# Altium project PCB_Project1.PrjPCB (part 1 of 2)
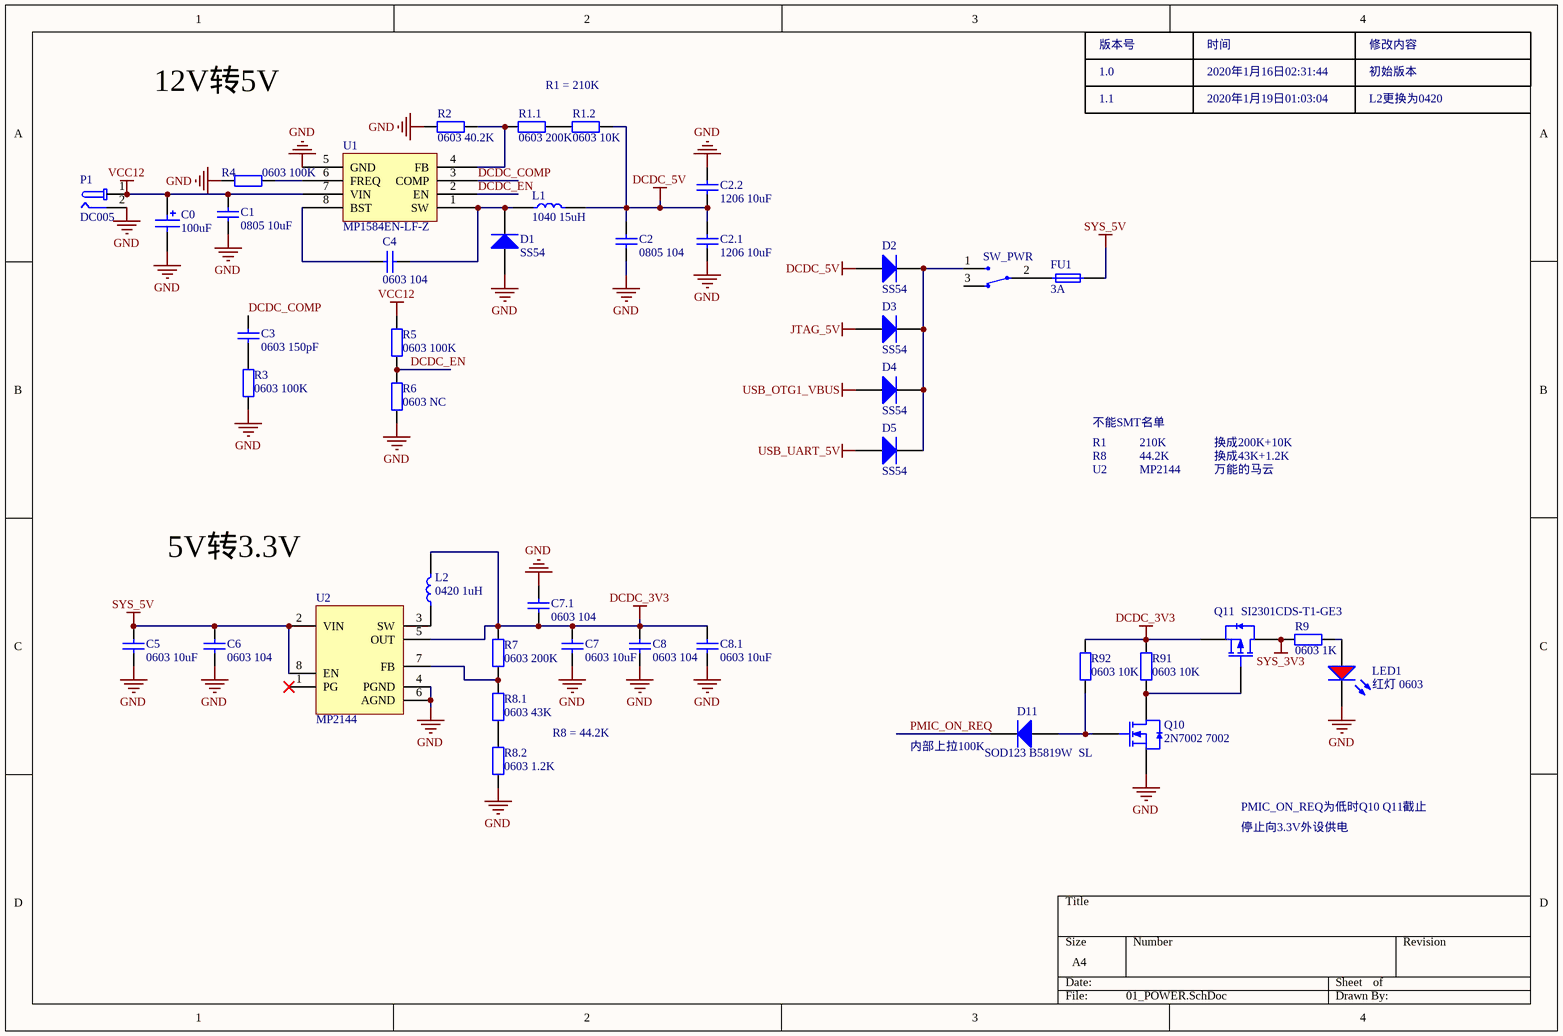
[diagram p0: 01_POWER.SchDoc]
12 sheets, 301 parts. Net scope: global (net labels, ports and power ports of the same name join across sheets).
Board file: PCB1.PcbDoc
Sheets:
  01_POWER.SchDoc
  02_BTB_IO.SchDoc
  03_ENET.SchDoc
  04_BOOT.SchDoc
  05_USB.SchDoc
  06_SDIO.SchDoc
  07_AUDIO.SchDoc
  08_PERIPHERAL.SchDoc
  09_RGB_LCD.SchDoc
  10_HDMI.SchDoc
  11_HDMI_CON.SchDoc
  12_IO.SchDoc

## Sheet 01_POWER.SchDoc
size A4

### Parts
C0  100uF  [CAP1]
C1  0805 10uF  [LC-0805_C]
C2  0805 104  [LC-0805_C]
C2.1  1206 10uF  [LC-1206_C]
C2.2  1206 10uF  [LC-1206_C]
C3  0603 150pF  [LC-0603_C]
C4  0603 104  [LC-0603_C]
C5  0603 10uF  [LC-0603_C]
C6  0603 104  [LC-0603_C]
C7  0603 10uF  [LC-0603_C]
C7.1  0603 104  [LC-0603_C]
C8  0603 104  [LC-0603_C]
C8.1  0603 10uF  [LC-0603_C]
D1  SS54  [LC-SMA(DO-214AC)_S1]
D2  SS54  [LC-SMA(DO-214AC)_S1]
D3  SS54  [LC-SMA(DO-214AC)_S1]
D4  SS54  [LC-SMA(DO-214AC)_S1]
D5  SS54  [LC-SMA(DO-214AC)_S1]
D11  SOD123 B5819W  SL  [LC-SOD-123]
FU1  3A  [1812_FUSOR]
L1  1040 15uH  [L_1040]
L2  0420 1uH  [L_0420]
LED1  红灯 0603  [LC-0603_LED_S1]
P1  DC005  [DC005]
Q10  2N7002 7002  [LC-SOT-23(SOT-23-3)]
Q11  SI2301CDS-T1-GE3  [LC-SOT-23(SOT-23-3)]
R1.1  0603 200K  [LC-0603_R]
R1.2  0603 10K  [LC-0603_R]
R2  0603 40.2K  [LC-0603_R]
R3  0603 100K  [LC-0603_R]
R4  0603 100K  [LC-0603_R]
R5  0603 100K  [LC-0603_R]
R6  0603 NC  [LC-0603_R]
R7  0603 200K  [LC-0603_R]
R8.1  0603 43K  [LC-0603_R]
R8.2  0603 1.2K  [LC-0603_R]
R9  0603 1K  [LC-0603_R]
R91  0603 10K  [LC-0603_R]
R92  0603 10K  [LC-0603_R]
SW_PWR  (no value)  [SW_3P1]
U1  MP1584EN-LF-Z  [LC-SOIC-8_EP_150mil]
U2  MP2144  [SOT23-8L]

### Nets
DCDC_3V3: C7.2 C7.1.2 C8.2 C8.1.2 L2.1 Q11.2(S) R7.2 R91.2 R92.2 U2.5(OUT)
DCDC_5V: C2.2 C2.1.2 C2.2.2 D2.1(A) L1.1 R1.2.2
GND: C0.2 C1.1 C2.1 C2.1.1 C2.2.1 C5.1 C6.1 C7.1 C7.1.1 C8.1 C8.1.1 D1.1(A) LED1.K P1.2 Q10.2(S) R2.1 R3.1 R4.1 R6.1 R8.2.1 U1.5(GND) U2.4(PGND) U2.6(AGND)
JTAG_5V: D3.1(A)
SYS_3V3: Q11.3(D) R9.2
SYS_5V: C5.2 C6.2 FU1.2 U2.2(VIN) U2.8(EN)
USB_OTG1_VBUS: D4.1(A)
USB_UART_5V: D5.1(A)
VCC12: C0.1 C1.2 P1.1 R5.2 U1.7(VIN)
DCDC_COMP: C3.2 U1.3(COMP)
DCDC_EN: R5.1 R6.2 U1.2(EN)
PMIC_ON_REQ: D11.2(K)
NetC3_1: C3.1 R3.2
NetC4_1: C4.1 U1.8(BST)
NetC4_2: C4.2 D1.2(K) L1.2 U1.1(SW)
NetD2_2: D2.2(K) D3.2(K) D4.2(K) D5.2(K) SW_PWR.1
NetD11_1: D11.1(A) Q10.1(G) R92.1
NetFU1_1: FU1.1 SW_PWR.2
NetL2_2: L2.2 U2.3(SW)
NetLED1_A: LED1.A R9.1
NetQ10_3: Q10.3(D) Q11.1(G) R91.1
NetR1.1_1: R1.1.1 R2.2 U1.4(FB)
NetR1.1_2: R1.1.2 R1.2.1
NetR4_2: R4.2 U1.6(FREQ)
NetR7_1: R7.1 R8.1.2 U2.7(FB)
NetR8.1_1: R8.1.1 R8.2.2

Not connected (* = marked no-connect by the designer): SW_PWR 3; U2 1(PG)*

### Notes on the sheet
- 12V转5V
- R1 = 210K
- 版本号
- 1.0
- 1.1
- 2020年1月16日02:31:44
- 时间
- 2020年1月19日01:03:04
- 修改内容
- 初始版本
- L2更换为0420
- R1
- 不能SMT名单
- 210K
- 换成200K+10K
- R8
- U2
- 44.2K
- MP2144
- 换成43K+1.2K
- 万能的马云
- 5V转3.3V
- R8 = 44.2K
- 内部上拉100K
- PMIC_ON_REQ为低时Q10 Q11截止
- 停止向3.3V外设供电

### Library data of the parts
C0 = CAP1
C1 C2 = 0805 10uF (106) 10% 25V: 贴片电容; ComponentLink1Description: 供应商链接; ComponentLink1URL: http://www.szlcsc.com/product/details_16532.html; Package: 0805; Supplier: LC; SuppliersPartNumber: C15850
C2.1 C2.2 = 1206 10uF (106) 10% 50V: 贴片电容; ComponentLink1Description: 供应商链接; ComponentLink1URL: http://www.szlcsc.com/product/details_14236.html; Package: 1206; Supplier: LC; SuppliersPartNumber: C13585
C3-C7 C7.1 C8 C8.1 = 0603 1uF (105) 10% 50V: 贴片电容; ComponentLink1Description: 供应商链接; ComponentLink1URL: http://www.szlcsc.com/product/details_16531.html; Package: 0603; Supplier: LC; SuppliersPartNumber: C15849
D1-D5 = SMA(DO-214AC) SS54: 二极管; ComponentLink1Description: 供应商链接; ComponentLink1URL: http://www.szlcsc.com/product/details_23178.html; Package: SMA(DO-214AC); Supplier: LC; SuppliersPartNumber: C22452
D11 = SOD-123 B5819W  SL: 肖特基二极管; ComponentLink1Description: 供应商链接; ComponentLink1URL: http://www.szlcsc.com/product/details_9093.html; Package: SOD-123; Supplier: LC; SuppliersPartNumber: C8598
FU1 = FU
L1 L2 = Inductor
LED1 = 0603 红灯: 发光二极管; ComponentLink1Description: 供应商链接; ComponentLink1URL: http://www.szlcsc.com/product/details_2659.html; Package: 0603; Supplier: LC; SuppliersPartNumber: C2286
Q10 = 2N7002 7002: MOS(场效应管); ComponentLink1Description: 供应商链接; ComponentLink1URL: http://www.szlcsc.com/product/details_9040.html; Package: SOT-23(SOT-23-3); Supplier: LC; SuppliersPartNumber: C8545
Q11 = SI2301CDS-T1-GE3: MOS(场效应管); ComponentLink1Description: 供应商链接; ComponentLink1URL: http://www.szlcsc.com/product/details_11030.html; Package: SOT-23(SOT-23-3); Supplier: LC; SuppliersPartNumber: C10487
R1.1 R1.2 R2-R7 R8.1 R8.2 R9 = 0603 2.2KΩ (2201) 1%: 贴片电阻; ComponentLink1Description: 供应商链接; ComponentLink1URL: http://www.szlcsc.com/product/details_4597.html; Package: 0603; Supplier: LC; SuppliersPartNumber: C4190
R91 R92 = 0603 1.1KΩ (1101) 1%: 贴片电阻; ComponentLink1Description: 供应商链接; ComponentLink1URL: http://www.szlcsc.com/product/details_23491.html; Package: 0603; Supplier: LC; SuppliersPartNumber: C22764
SW_PWR = SW_3P
U1 = MP1584EN-LF-Z: DC-DC芯片; ComponentLink1Description: 供应商链接; ComponentLink1URL: http://www.szlcsc.com/product/details_15724.html; Package: SOIC-8_EP_150mil; Supplier: LC; SuppliersPartNumber: C15051

## Sheet 02_BTB_IO.SchDoc
size A4
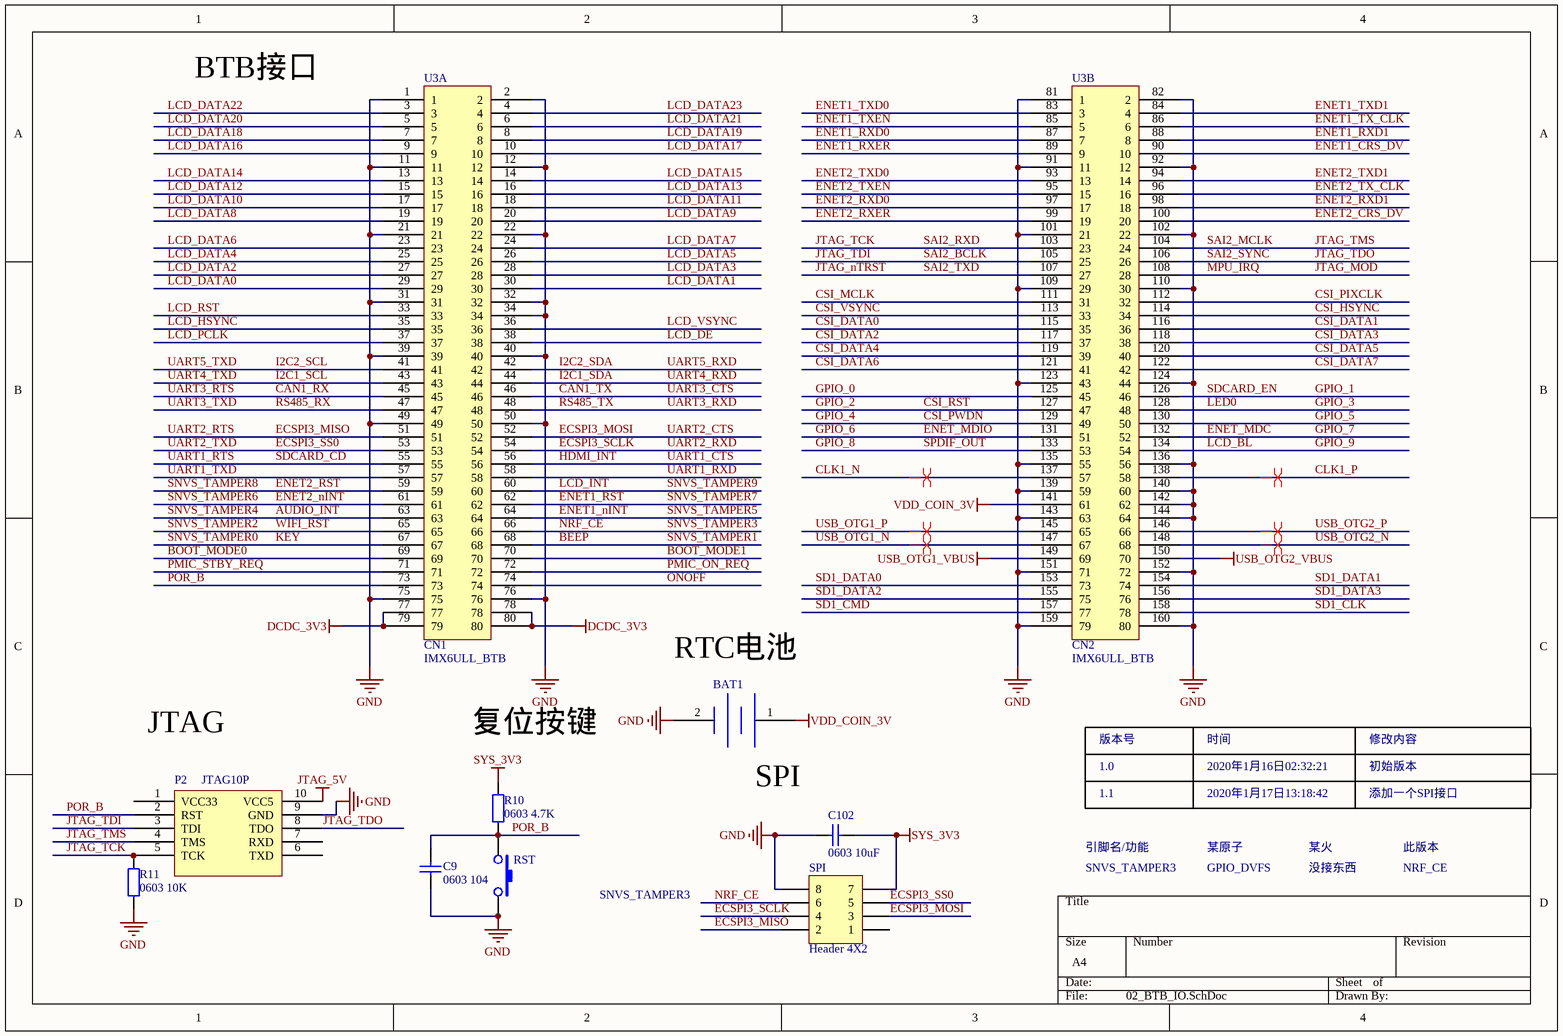
[diagram p1: 02_BTB_IO.SchDoc]

### Parts
BAT1  (no value)  [CR1220]
C9  0603 104  [LC-0603_C]
C102  0603 10uF  [LC-0603_C]
P2  JTAG10P  [JTAG10P2]
R10  0603 4.7K  [LC-0603_R]
R11  0603 10K  [LC-0603_R]
RST  (no value)  [KEY2]
SPI  Header 4X2  [HDR2X4]
U3  IMX6ULL_BTB  [IMX6ULL_BTB]  (parts A,B of 2)

### Nets
DCDC_3V3: U3.77 U3.78 U3.79 U3.80
GND: BAT1.2 C9.1 C102.1 P2.9(GND) R11.1 RST.2 SPI.8 U3.1 U3.2 U3.11 U3.12 U3.21 U3.22 U3.31 U3.32 U3.34 U3.39 U3.40 U3.49 U3.50 U3.75 U3.76 U3.81(1) U3.82(2) U3.91(11) U3.92(12) U3.101(21) U3.102(22) U3.109(29) U3.110(30) U3.123(43) U3.124(44) U3.135(55) U3.136(56) U3.139(59) U3.140(60) U3.142(62) U3.143(63) U3.144(64) U3.151(71) U3.152(72) U3.159(79) U3.160(80)
JTAG_5V: P2.10(VCC5)
SYS_3V3: C102.2 R10.2 SPI.7
USB_OTG1_VBUS: U3.149(69)
USB_OTG2_VBUS: U3.150(70)  [project net SYS_5V]
VDD_COIN_3V: BAT1.1 U3.141(61)
AUDIO_INT: U3.63  [also labelled SNVS_TAMPER4]
BEEP: U3.68  [also labelled SNVS_TAMPER1]
BOOT_MODE0: U3.69
BOOT_MODE1: U3.70
CAN1_RX: U3.45  [also labelled UART3_RTS]
CAN1_TX: U3.46  [also labelled UART3_CTS]
CLK1_N: U3.137(57)
CLK1_P: U3.138(58)
CSI_DATA0: U3.115(35)
CSI_DATA1: U3.116(36)
CSI_DATA2: U3.117(37)
CSI_DATA3: U3.118(38)
CSI_DATA4: U3.119(39)
CSI_DATA5: U3.120(40)
CSI_DATA6: U3.121(41)
CSI_DATA7: U3.122(42)
CSI_HSYNC: U3.114(34)
CSI_MCLK: U3.111(31)
CSI_PIXCLK: U3.112(32)
CSI_PWDN: U3.129(49)  [also labelled GPIO_4]
CSI_RST: U3.127(47)  [also labelled GPIO_2]
CSI_VSYNC: U3.113(33)
ECSPI3_MISO: SPI.2 U3.51  [also labelled UART2_RTS]
ECSPI3_MOSI: SPI.3 U3.52  [also labelled UART2_CTS]
ECSPI3_SCLK: SPI.4 U3.54  [also labelled UART2_RXD]
ECSPI3_SS0: SPI.5 U3.53  [also labelled UART2_TXD]
ENET1_CRS_DV: U3.90(10)
ENET1_nINT: U3.64  [also labelled SNVS_TAMPER5]
ENET1_RST: U3.62  [also labelled SNVS_TAMPER7]
ENET1_RXD0: U3.87(7)
ENET1_RXD1: U3.88(8)
ENET1_RXER: U3.89(9)
ENET1_TX_CLK: U3.86(6)
ENET1_TXD0: U3.83(3)
ENET1_TXD1: U3.84(4)
ENET1_TXEN: U3.85(5)
ENET2_CRS_DV: U3.100(20)
ENET2_nINT: U3.61  [also labelled SNVS_TAMPER6]
ENET2_RST: U3.59  [also labelled SNVS_TAMPER8]
ENET2_RXD0: U3.97(17)
ENET2_RXD1: U3.98(18)
ENET2_RXER: U3.99(19)
ENET2_TX_CLK: U3.96(16)
ENET2_TXD0: U3.93(13)
ENET2_TXD1: U3.94(14)
ENET2_TXEN: U3.95(15)
ENET_MDC: U3.132(52)  [also labelled GPIO_7]
ENET_MDIO: U3.131(51)  [also labelled GPIO_6]
GPIO_0: U3.125(45)
GPIO_1: U3.126(46)  [also labelled SDCARD_EN]
GPIO_3: U3.128(48)  [also labelled LED0]
GPIO_5: U3.130(50)
GPIO_8: U3.133(53)  [also labelled SPDIF_OUT]
GPIO_9: U3.134(54)  [also labelled LCD_BL]
HDMI_INT: U3.56  [also labelled UART1_CTS]
I2C1_SCL: U3.43  [also labelled UART4_TXD]
I2C1_SDA: U3.44  [also labelled UART4_RXD]
I2C2_SCL: U3.41  [also labelled UART5_TXD]
I2C2_SDA: U3.42  [also labelled UART5_RXD]
JTAG_MOD: U3.108(28)  [also labelled MPU_IRQ]
JTAG_nTRST: U3.107(27)  [also labelled SAI2_TXD]
JTAG_TCK: P2.5(TCK) R11.2 U3.103(23)  [also labelled SAI2_RXD]
JTAG_TDI: P2.3(TDI) U3.105(25)  [also labelled SAI2_BCLK]
JTAG_TDO: P2.8(TDO) U3.106(26)  [also labelled SAI2_SYNC]
JTAG_TMS: P2.4(TMS) U3.104(24)  [also labelled SAI2_MCLK]
KEY: U3.67  [also labelled SNVS_TAMPER0]
LCD_DATA0: U3.29
LCD_DATA1: U3.30
LCD_DATA2: U3.27
LCD_DATA3: U3.28
LCD_DATA4: U3.25
LCD_DATA5: U3.26
LCD_DATA6: U3.23
LCD_DATA7: U3.24
LCD_DATA8: U3.19
LCD_DATA9: U3.20
LCD_DATA10: U3.17
LCD_DATA11: U3.18
LCD_DATA12: U3.15
LCD_DATA13: U3.16
LCD_DATA14: U3.13
LCD_DATA15: U3.14
LCD_DATA16: U3.9
LCD_DATA17: U3.10
LCD_DATA18: U3.7
LCD_DATA19: U3.8
LCD_DATA20: U3.5
LCD_DATA21: U3.6
LCD_DATA22: U3.3
LCD_DATA23: U3.4
LCD_DE: U3.38
LCD_HSYNC: U3.35
LCD_INT: U3.60  [also labelled SNVS_TAMPER9]
LCD_PCLK: U3.37
LCD_RST: U3.33
LCD_VSYNC: U3.36
NRF_CE: SPI.6 U3.66  [also labelled SNVS_TAMPER3]
ONOFF: U3.74
PMIC_ON_REQ: U3.72
PMIC_STBY_REQ: U3.71
POR_B: C9.2 P2.2(RST) R10.1 RST.1 U3.73
RS485_RX: U3.47  [also labelled UART3_TXD]
RS485_TX: U3.48  [also labelled UART3_RXD]
SD1_CLK: U3.158(78)
SD1_CMD: U3.157(77)
SD1_DATA0: U3.153(73)
SD1_DATA1: U3.154(74)
SD1_DATA2: U3.155(75)
SD1_DATA3: U3.156(76)
SDCARD_CD: U3.55  [also labelled UART1_RTS]
SNVS_TAMPER2: U3.65  [also labelled WIFI_RST]
UART1_RXD: U3.58
UART1_TXD: U3.57
USB_OTG1_N: U3.147(67)
USB_OTG1_P: U3.145(65)
USB_OTG2_N: U3.148(68)
USB_OTG2_P: U3.146(66)

Not connected (* = marked no-connect by the designer): P2 1(VCC33) 6(TXD) 7(RXD); SPI 1

### Layout directives
differential pair: CLK1_N, CLK1_P, USB_OTG1_N, USB_OTG1_P, USB_OTG2_N, USB_OTG2_P

### Notes on the sheet
- BTB接口
- RTC电池
- JTAG
- 复位按键
- SPI
- 版本号
- 1.0
- 2020年1月16日02:32:21
- 时间
- 修改内容
- 初始版本
- 引脚名/功能
- 1.1
- 某原子
- 2020年1月17日13:18:42
- 某火
- 添加一个SPI接口
- 此版本
- SNVS_TAMPER3
- GPIO_DVFS
- 没接东西
- NRF_CE
- (in symbol IMX6ULL_BTB, part A) CN1
- (in symbol IMX6ULL_BTB, part B) CN2

### Library data of the parts
BAT1 = RTC电池
C9 C102 = 0603 1.5nF (152) 10% 50V: 贴片电容; ComponentLink1Description: 供应商链接; ComponentLink1URL: http://www.szlcsc.com/product/details_1947.html; Package: 0603; Supplier: LC; SuppliersPartNumber: C1595
R10 R11 = 0603 1.1KΩ (1101) 1%: 贴片电阻; ComponentLink1Description: 供应商链接; ComponentLink1URL: http://www.szlcsc.com/product/details_23491.html; Package: 0603; Supplier: LC; SuppliersPartNumber: C22764
RST = KEY
SPI = Header 4X2: Header, 4-Pin, Dual row; LatestRevisionDate: 17-Jul-2002; LatestRevisionNote: Re-released for DXP Platform.; Publisher: Altium Limited

## Sheet 03_ENET.SchDoc
size A4
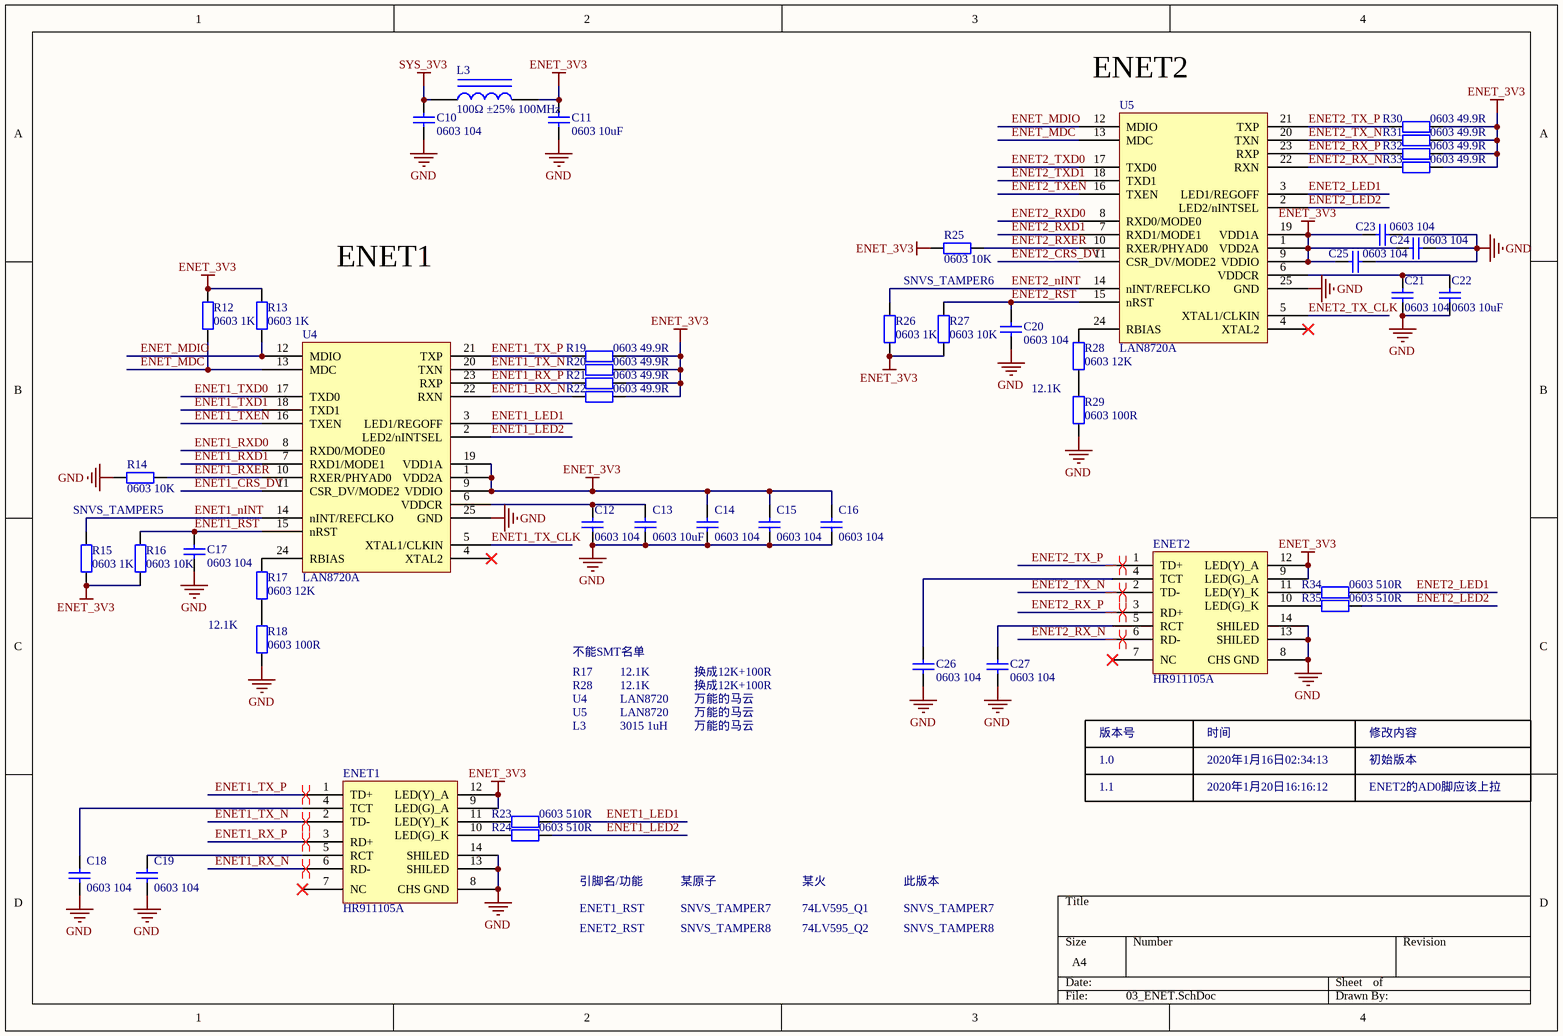
[diagram p2: 03_ENET.SchDoc]

### Parts
C10  0603 104  [LC-0603_C]
C11  0603 10uF  [LC-0603_C]
C12  0603 104  [LC-0603_C]
C13  0603 10uF  [LC-0603_C]
C14  0603 104  [LC-0603_C]
C15  0603 104  [LC-0603_C]
C16  0603 104  [LC-0603_C]
C17  0603 104  [LC-0603_C]
C18  0603 104  [LC-0603_C]
C19  0603 104  [LC-0603_C]
C20  0603 104  [LC-0603_C]
C21  0603 104  [LC-0603_C]
C22  0603 10uF  [LC-0603_C]
C23  0603 104  [LC-0603_C]
C24  0603 104  [LC-0603_C]
C25  0603 104  [LC-0603_C]
C26  0603 104  [LC-0603_C]
C27  0603 104  [LC-0603_C]
ENET1  HR911105A  [HR911105A]
ENET2  HR911105A  [HR911105A]
L3  100Ω ±25% 100MHz  [LC-0805_L]
R12  0603 1K  [LC-0603_R]
R13  0603 1K  [LC-0603_R]
R14  0603 10K  [LC-0603_R]
R15  0603 1K  [LC-0603_R]
R16  0603 10K  [LC-0603_R]
R17  0603 12K  [LC-0603_R]
R18  0603 100R  [LC-0603_R]
R19  0603 49.9R  [LC-0603_R]
R20  0603 49.9R  [LC-0603_R]
R21  0603 49.9R  [LC-0603_R]
R22  0603 49.9R  [LC-0603_R]
R23  0603 510R  [LC-0603_R]
R24  0603 510R  [LC-0603_R]
R25  0603 10K  [LC-0603_R]
R26  0603 1K  [LC-0603_R]
R27  0603 10K  [LC-0603_R]
R28  0603 12K  [LC-0603_R]
R29  0603 100R  [LC-0603_R]
R30  0603 49.9R  [LC-0603_R]
R31  0603 49.9R  [LC-0603_R]
R32  0603 49.9R  [LC-0603_R]
R33  0603 49.9R  [LC-0603_R]
R34  0603 510R  [LC-0603_R]
R35  0603 510R  [LC-0603_R]
U4  LAN8720A  [QFN-24_4x4x05P]
U5  LAN8720A  [QFN-24_4x4x05P]

### Nets
ENET_3V3: C11.2 C14.2 C15.2 C16.2 C23.2 C24.2 C25.2 ENET1.9(LED(G)_A) ENET1.12(LED(Y)_A) ENET2.9(LED(G)_A) ENET2.12(LED(Y)_A) L3.2 R12.2 R13.2 R15.2 R16.2 R19.2 R20.2 R21.2 R22.2 R25.2 R26.2 R27.2 R30.2 R31.2 R32.2 R33.2 U4.1(VDD2A) U4.9(VDDIO) U4.19(VDD1A) U5.1(VDD2A) U5.9(VDDIO) U5.19(VDD1A)
GND: C10.1 C11.1 C12.1 C13.1 C14.1 C15.1 C16.1 C17.1 C18.1 C19.1 C20.1 C21.1 C22.1 C23.1 C24.1 C25.1 C26.2 C27.2 ENET1.8(CHS_GND) ENET1.13(SHILED) ENET1.14(SHILED) ENET2.8(CHS_GND) ENET2.13(SHILED) ENET2.14(SHILED) R14.2 R18.2 R29.2 U4.25(GND) U5.25(GND)
SYS_3V3: C10.2 L3.1
ENET1_CRS_DV: U4.11(CSR_DV/MODE2)
ENET1_LED1: R23.2 U4.3(LED1/REGOFF)
ENET1_LED2: R24.2 U4.2(LED2/nINTSEL)
ENET1_nINT: R15.1 U4.14(nINT/REFCLKO)
ENET1_RST: C17.2 R16.1 U4.15(nRST)
ENET1_RX_N: ENET1.6(RD-) R22.1 U4.22(RXN)
ENET1_RX_P: ENET1.3(RD+) R21.1 U4.23(RXP)
ENET1_RXD0: U4.8(RXD0/MODE0)
ENET1_RXD1: U4.7(RXD1/MODE1)
ENET1_RXER: R14.1 U4.10(RXER/PHYAD0)
ENET1_TX_CLK: U4.5(XTAL1/CLKIN)
ENET1_TX_N: ENET1.2(TD-) R20.1 U4.20(TXN)
ENET1_TX_P: ENET1.1(TD+) R19.1 U4.21(TXP)
ENET1_TXD0: U4.17(TXD0)
ENET1_TXD1: U4.18(TXD1)
ENET1_TXEN: U4.16(TXEN)
ENET2_CRS_DV: U5.11(CSR_DV/MODE2)
ENET2_LED1: R34.2 U5.3(LED1/REGOFF)
ENET2_LED2: R35.2 U5.2(LED2/nINTSEL)
ENET2_nINT: R26.1 U5.14(nINT/REFCLKO)
ENET2_RST: C20.2 R27.1 U5.15(nRST)
ENET2_RX_N: ENET2.6(RD-) R33.1 U5.22(RXN)
ENET2_RX_P: ENET2.3(RD+) R32.1 U5.23(RXP)
ENET2_RXD0: U5.8(RXD0/MODE0)
ENET2_RXD1: U5.7(RXD1/MODE1)
ENET2_RXER: R25.1 U5.10(RXER/PHYAD0)
ENET2_TX_CLK: U5.5(XTAL1/CLKIN)
ENET2_TX_N: ENET2.2(TD-) R31.1 U5.20(TXN)
ENET2_TX_P: ENET2.1(TD+) R30.1 U5.21(TXP)
ENET2_TXD0: U5.17(TXD0)
ENET2_TXD1: U5.18(TXD1)
ENET2_TXEN: U5.16(TXEN)
ENET_MDC: R12.1 U4.13(MDC) U5.13(MDC)
ENET_MDIO: R13.1 U4.12(MDIO) U5.12(MDIO)
NetC12_2: C12.2 C13.2 U4.6(VDDCR)
NetC18_2: C18.2 ENET1.4(TCT)
NetC19_2: C19.2 ENET1.5(RCT)
NetC21_2: C21.2 C22.2 U5.6(VDDCR)
NetC26_1: C26.1 ENET2.4(TCT)
NetC27_1: C27.1 ENET2.5(RCT)
NetENET1_10: ENET1.10(LED(G)_K) R24.1
NetENET1_11: ENET1.11(LED(Y)_K) R23.1
NetENET2_10: ENET2.10(LED(G)_K) R35.1
NetENET2_11: ENET2.11(LED(Y)_K) R34.1
NetR17_1: R17.1 U4.24(RBIAS)
NetR17_2: R17.2 R18.1
NetR28_1: R28.1 U5.24(RBIAS)
NetR28_2: R28.2 R29.1

Not connected (* = marked no-connect by the designer): ENET1 7(NC)*; ENET2 7(NC)*; U4 4(XTAL2)*; U5 4(XTAL2)*

### Layout directives
differential pair: ENET1_RX_N, ENET1_RX_P, ENET1_TX_N, ENET1_TX_P, ENET2_RX_N, ENET2_RX_P, ENET2_TX_N, ENET2_TX_P

### Notes on the sheet
- (near U5) ENET2
- ENET1
- SNVS_TAMPER6
- 12.1K
- SNVS_TAMPER5
- 不能SMT名单
- R17
- R28
- U4
- U5
- LAN8720
- 换成12K+100R
- 万能的马云
- L3
- 3015 1uH
- 版本号
- 1.0
- 1.1
- 2020年1月16日02:34:13
- 时间
- 2020年1月20日16:16:12
- 修改内容
- 初始版本
- ENET2的AD0脚应该上拉
- ENET1_RST
- 引脚名/功能
- SNVS_TAMPER7
- 某原子
- 74LV595_Q1
- 某火
- 此版本
- ENET2_RST
- SNVS_TAMPER8
- 74LV595_Q2

### Library data of the parts
C10-C27 = 0603 1.5nF (152) 10% 50V: 贴片电容; ComponentLink1Description: 供应商链接; ComponentLink1URL: http://www.szlcsc.com/product/details_1947.html; Package: 0603; Supplier: LC; SuppliersPartNumber: C1595
L3 = 0805 100Ω 25% 100MHz: 贴片磁珠; ComponentLink1URL: http://www.szlcsc.com/product/details_1367.html; Package: 0805; Supplier: LC; SuppliersPartNumber: C1015
R12-R35 = 0603 1.1KΩ (1101) 1%: 贴片电阻; ComponentLink1Description: 供应商链接; ComponentLink1URL: http://www.szlcsc.com/product/details_23491.html; Package: 0603; Supplier: LC; SuppliersPartNumber: C22764

## Sheet 04_BOOT.SchDoc
size A4
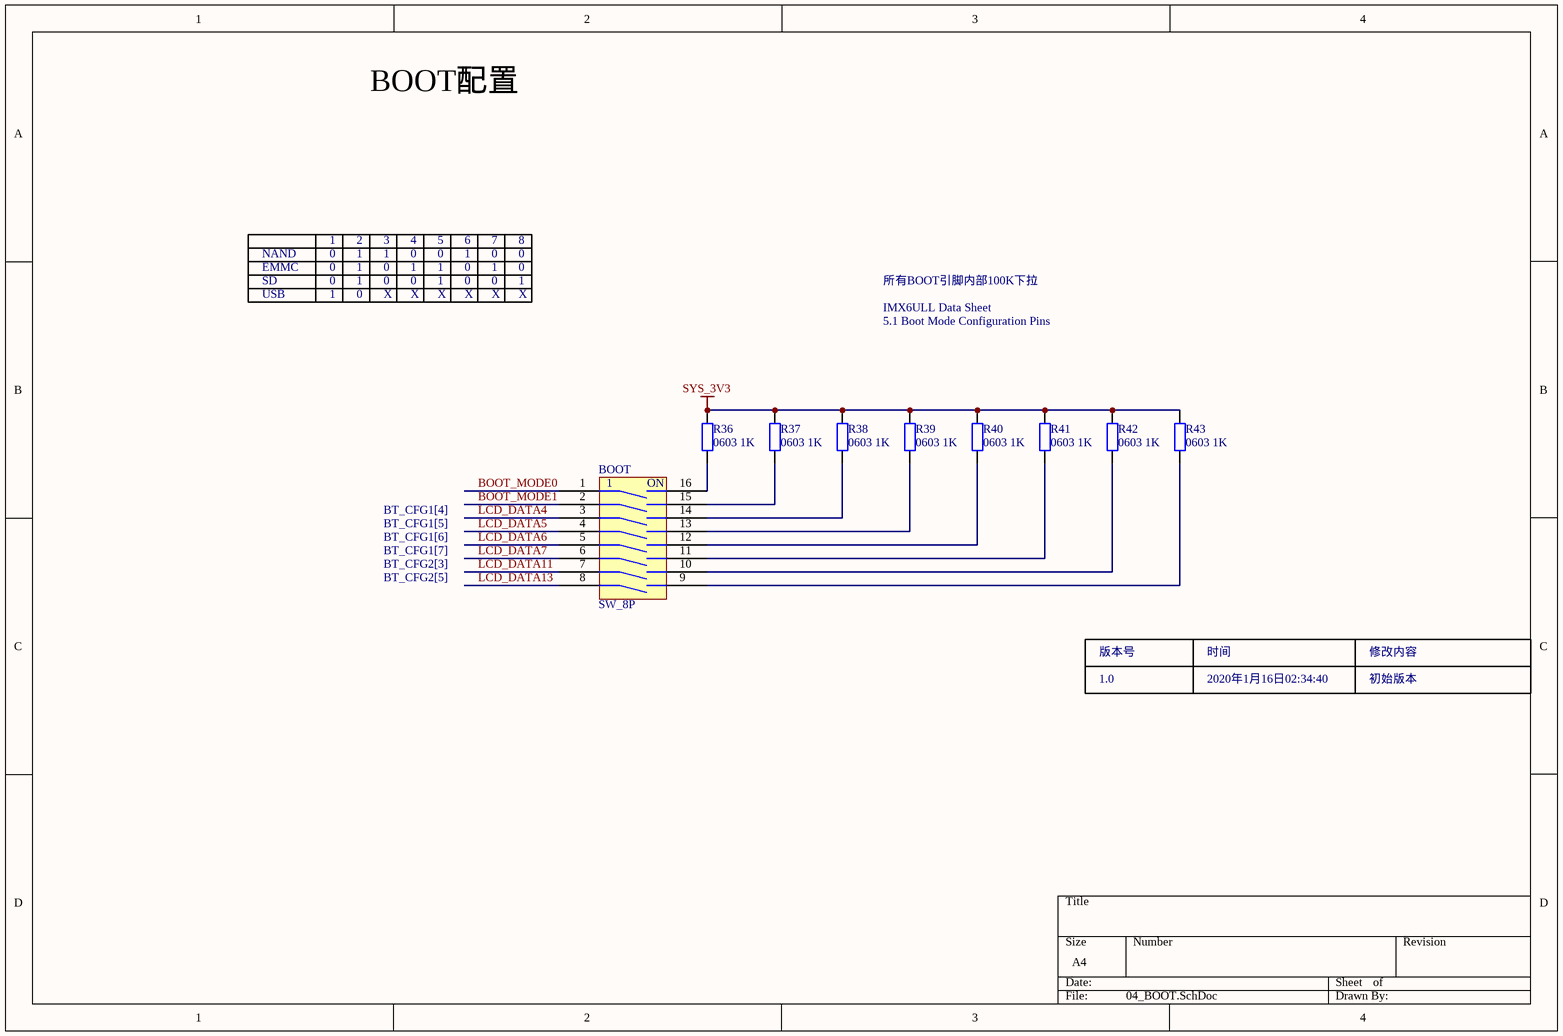
[diagram p3: 04_BOOT.SchDoc]

### Parts
BOOT  SW_8P  [SW_8P_2.54]
R36  0603 1K  [LC-0603_R]
R37  0603 1K  [LC-0603_R]
R38  0603 1K  [LC-0603_R]
R39  0603 1K  [LC-0603_R]
R40  0603 1K  [LC-0603_R]
R41  0603 1K  [LC-0603_R]
R42  0603 1K  [LC-0603_R]
R43  0603 1K  [LC-0603_R]

### Nets
SYS_3V3: R36.2 R37.2 R38.2 R39.2 R40.2 R41.2 R42.2 R43.2
BOOT_MODE0: BOOT.1
BOOT_MODE1: BOOT.2
LCD_DATA4: BOOT.3
LCD_DATA5: BOOT.4
LCD_DATA6: BOOT.5
LCD_DATA7: BOOT.6
LCD_DATA11: BOOT.7
LCD_DATA13: BOOT.8
NetBOOT_9: BOOT.9 R43.1
NetBOOT_10: BOOT.10 R42.1
NetBOOT_11: BOOT.11 R41.1
NetBOOT_12: BOOT.12 R40.1
NetBOOT_13: BOOT.13 R39.1
NetBOOT_14: BOOT.14 R38.1
NetBOOT_15: BOOT.15 R37.1
NetBOOT_16: BOOT.16 R36.1

### Notes on the sheet
- BOOT配置
- 1
- 2
- 3
- 4
- 5
- 6
- 7
- 8
- NAND
- EMMC
- SD
- USB
- 0
- X
- 所有BOOT引脚内部100K下拉
- IMX6ULL Data Sheet
- 5.1 Boot Mode Configuration Pins
- BT_CFG1[4]
- BT_CFG1[5]
- BT_CFG1[6]
- BT_CFG1[7]
- BT_CFG2[3]
- BT_CFG2[5]
- 版本号
- 时间
- 修改内容
- 1.0
- 2020年1月16日02:34:40
- 初始版本
- (in symbol SW_8P) ON

### Library data of the parts
R36-R43 = 0603 1.1KΩ (1101) 1%: 贴片电阻; ComponentLink1Description: 供应商链接; ComponentLink1URL: http://www.szlcsc.com/product/details_23491.html; Package: 0603; Supplier: LC; SuppliersPartNumber: C22764

## Sheet 05_USB.SchDoc
size A4
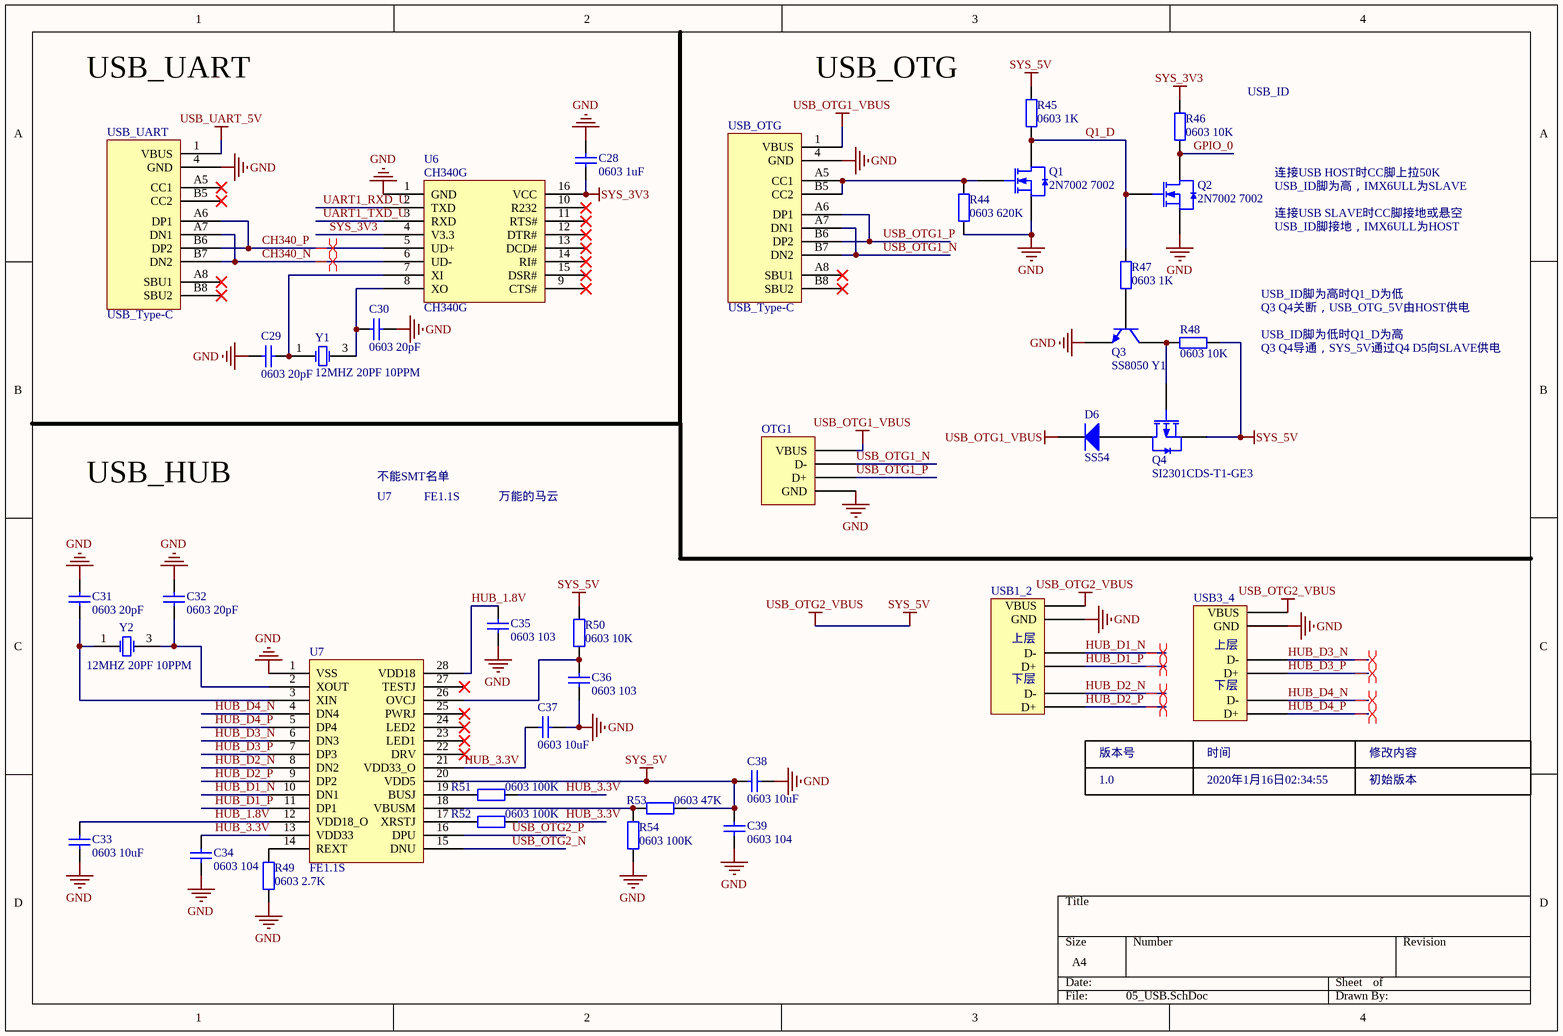
[diagram p4: 05_USB.SchDoc]

### Parts
C28  0603 1uF  [LC-0603_C]
C29  0603 20pF  [LC-0603_C]
C30  0603 20pF  [LC-0603_C]
C31  0603 20pF  [LC-0603_C]
C32  0603 20pF  [LC-0603_C]
C33  0603 10uF  [LC-0603_C]
C34  0603 104  [LC-0603_C]
C35  0603 103  [LC-0603_C]
C36  0603 103  [LC-0603_C]
C37  0603 10uF  [LC-0603_C]
C38  0603 10uF  [LC-0603_C]
C39  0603 104  [LC-0603_C]
D6  SS54  [LC-SMA(DO-214AC)_S1]
OTG1  (no value)  [USB插座_侧插]
Q1  2N7002 7002  [LC-SOT-23(SOT-23-3)]
Q2  2N7002 7002  [LC-SOT-23(SOT-23-3)]
Q3  SS8050 Y1  [LC-SOT-23(SOT-23-3)]
Q4  SI2301CDS-T1-GE3  [LC-SOT-23(SOT-23-3)]
R44  0603 620K  [LC-0603_R]
R45  0603 1K  [LC-0603_R]
R46  0603 10K  [LC-0603_R]
R47  0603 1K  [LC-0603_R]
R48  0603 10K  [LC-0603_R]
R49  0603 2.7K  [LC-0603_R]
R50  0603 10K  [LC-0603_R]
R51  0603 100K  [LC-0603_R]
R52  0603 100K  [LC-0603_R]
R53  0603 47K  [LC-0603_R]
R54  0603 100K  [LC-0603_R]
U6  CH340G  [LC-SOIC-16_150mil]
U7  FE1.1S  [LC-SSOP-28_150mil]
USB1_2  (no value)  [USB插座_双层]
USB3_4  (no value)  [USB插座_双层]
USB_OTG  USB_Type-C  [Type-C 16P]
USB_UART  USB_Type-C  [Type-C 16P]
Y1  12MHZ 20PF 10PPM  [LC-SMD-3225_4P]
Y2  12MHZ 20PF 10PPM  [LC-SMD-3225_4P]

### Nets
GND: C28.2 C29.2 C30.1 C31.1 C32.1 C33.2 C34.2 C35.2 C36.2 C37.2 C38.1 C39.2 OTG1.0(GND) Q1.2(S) Q2.2(S) Q3.2(E) R44.1 R49.1 R54.2 U6.1(GND) U7.1(VSS) USB1_2.0(GND) USB3_4.0(GND) USB_OTG.4(GND) USB_UART.4(GND)
SYS_3V3: C28.1 R46.2 U6.4(V3.3) U6.16(VCC)
SYS_5V: C38.2 C39.1 Q4.2(S) R45.2 R48.1 R50.2 R53.1 U7.20(VDD5) USB1_2.3(VBUS) USB3_4.3(VBUS)  [also labelled USB_OTG2_VBUS]
USB_OTG1_VBUS: D6.2(K) OTG1.3(VBUS) USB_OTG.1(VBUS)
USB_UART_5V: USB_UART.1(VBUS)
CH340_N: U6.6(UD-) USB_UART.A7(DN1) USB_UART.B7(DN2)
CH340_P: U6.5(UD+) USB_UART.A6(DP1) USB_UART.B6(DP2)
GPIO_0: Q2.3(D) R46.1
HUB_1.8V: C33.1 C35.1 U7.12(VDD18_O) U7.28(VDD18)
HUB_3.3V: C34.1 C37.1 R51.1 R52.1 U7.13(VDD33) U7.21(VDD33_O)
HUB_D1_N: U7.10(DN1) USB1_2.2(D-)
HUB_D1_P: U7.11(DP1) USB1_2.1(D+)
HUB_D2_N: U7.8(DN2) USB1_2.5(D-)
HUB_D2_P: U7.9(DP2) USB1_2.4(D+)
HUB_D3_N: U7.6(DN3) USB3_4.2(D-)
HUB_D3_P: U7.7(DP3) USB3_4.1(D+)
HUB_D4_N: U7.4(DN4) USB3_4.5(D-)
HUB_D4_P: U7.5(DP4) USB3_4.4(D+)
Q1_D: Q1.3(D) Q2.1(G) R45.1 R47.2
UART1_RXD_U: U6.2(TXD)
UART1_TXD_U: U6.3(RXD)
USB_OTG1_N: OTG1.2(D-) USB_OTG.A7(DN1) USB_OTG.B7(DN2)
USB_OTG1_P: OTG1.1(D+) USB_OTG.A6(DP1) USB_OTG.B6(DP2)
USB_OTG2_N: U7.15(DNU)
USB_OTG2_P: U7.16(DPU)
NetC29_1: C29.1 U6.7(XI) Y1.1(OSC1)
NetC30_2: C30.2 U6.8(XO) Y1.3(OSC2)
NetC31_2: C31.2 U7.3(XIN) Y2.1(OSC1)
NetC32_2: C32.2 U7.2(XOUT) Y2.3(OSC2)
NetC36_1: C36.1 R50.1 U7.26(OVCJ)
NetD6_1: D6.1(A) Q4.3(D)
NetQ1_1: Q1.1(G) R44.2 USB_OTG.A5(CC1) USB_OTG.B5(CC2)
NetQ3_1: Q3.1(B) R47.1
NetQ3_3: Q3.3(C) Q4.1(G) R48.2
NetR49_2: R49.2 U7.14(REXT)
NetR51_2: R51.2 U7.19(BUSJ)
NetR52_2: R52.2 U7.17(XRSTJ)
NetR53_2: R53.2 R54.1 U7.18(VBUSM)

Not connected (* = marked no-connect by the designer): U6 9(CTS#)* 10(R232)* 11(RTS#)* 12(DTR#)* 13(DCD#)* 14(RI#)* 15(DSR#)*; U7 22(DRV)* 23(LED1)* 24(LED2)* 25(PWRJ)* 27(TESTJ)*; USB_OTG A8(SBU1)* B8(SBU2)*; USB_UART A5(CC1)* A8(SBU1)* B5(CC2)* B8(SBU2)*

### Layout directives
differential pair: CH340_N, CH340_P, HUB_D1_N, HUB_D1_P, HUB_D2_N, HUB_D2_P, HUB_D3_N, HUB_D3_P, HUB_D4_N, HUB_D4_P

### Notes on the sheet
- USB_UART
- USB_OTG
- USB_ID
- 连接USB HOST时CC脚上拉50K
- USB_ID脚为高，IMX6ULL为SLAVE
- 连接USB SLAVE时CC脚接地或悬空
- USB_ID脚接地，IMX6ULL为HOST
- USB_ID脚为高时Q1_D为低
- Q3 Q4关断，USB_OTG_5V由HOST供电
- USB_ID脚为低时Q1_D为高
- Q3 Q4导通，SYS_5V通过Q4 D5向SLAVE供电
- USB_HUB
- U7
- 不能SMT名单
- FE1.1S
- 万能的马云
- 版本号
- 1.0
- 2020年1月16日02:34:55
- (near USB3_4) 时间
- 修改内容
- 初始版本
- (in symbol USB双层插座) 上层; 下层

### Library data of the parts
C28-C39 = 0603 1.5nF (152) 10% 50V: 贴片电容; ComponentLink1Description: 供应商链接; ComponentLink1URL: http://www.szlcsc.com/product/details_1947.html; Package: 0603; Supplier: LC; SuppliersPartNumber: C1595
D6 = SMA(DO-214AC) SS54: 二极管; ComponentLink1Description: 供应商链接; ComponentLink1URL: http://www.szlcsc.com/product/details_23178.html; Package: SMA(DO-214AC); Supplier: LC; SuppliersPartNumber: C22452
OTG1 = USB_插座
Q1 Q2 = 2N7002 7002: MOS(场效应管); ComponentLink1Description: 供应商链接; ComponentLink1URL: http://www.szlcsc.com/product/details_9040.html; Package: SOT-23(SOT-23-3); Supplier: LC; SuppliersPartNumber: C8545
Q3 = SOT-23 SS8050 Y1: 三极管; ComponentLink1Description: 供应商链接; ComponentLink1URL: http://www.szlcsc.com/product/details_2507.html; Package: SOT-23; Supplier: LC; SuppliersPartNumber: C2150
Q4 = SI2301CDS-T1-GE3: MOS(场效应管); ComponentLink1Description: 供应商链接; ComponentLink1URL: http://www.szlcsc.com/product/details_11030.html; Package: SOT-23(SOT-23-3); Supplier: LC; SuppliersPartNumber: C10487
R44-R54 = 0603 1.1KΩ (1101) 1%: 贴片电阻; ComponentLink1Description: 供应商链接; ComponentLink1URL: http://www.szlcsc.com/product/details_23491.html; Package: 0603; Supplier: LC; SuppliersPartNumber: C22764
U6 = CH340G: USB; ComponentLink1Description: 供应商链接; ComponentLink1URL: http://www.szlcsc.com/product/details_14927.html; Package: SOIC-16_150mil; Supplier: LC; SuppliersPartNumber: C14267
USB1_2 USB3_4 = USB双层插座
Y1 Y2 = SMD-3225_4P  12MHZ 20PF 10PPM: 贴片晶振; ComponentLink1Description: 供应商链接; ComponentLink1URL: http://www.szlcsc.com/product/details_9522.html; Package: SMD-3225_4P; Supplier: LC; SuppliersPartNumber: C9002

## Sheet 06_SDIO.SchDoc
size A4
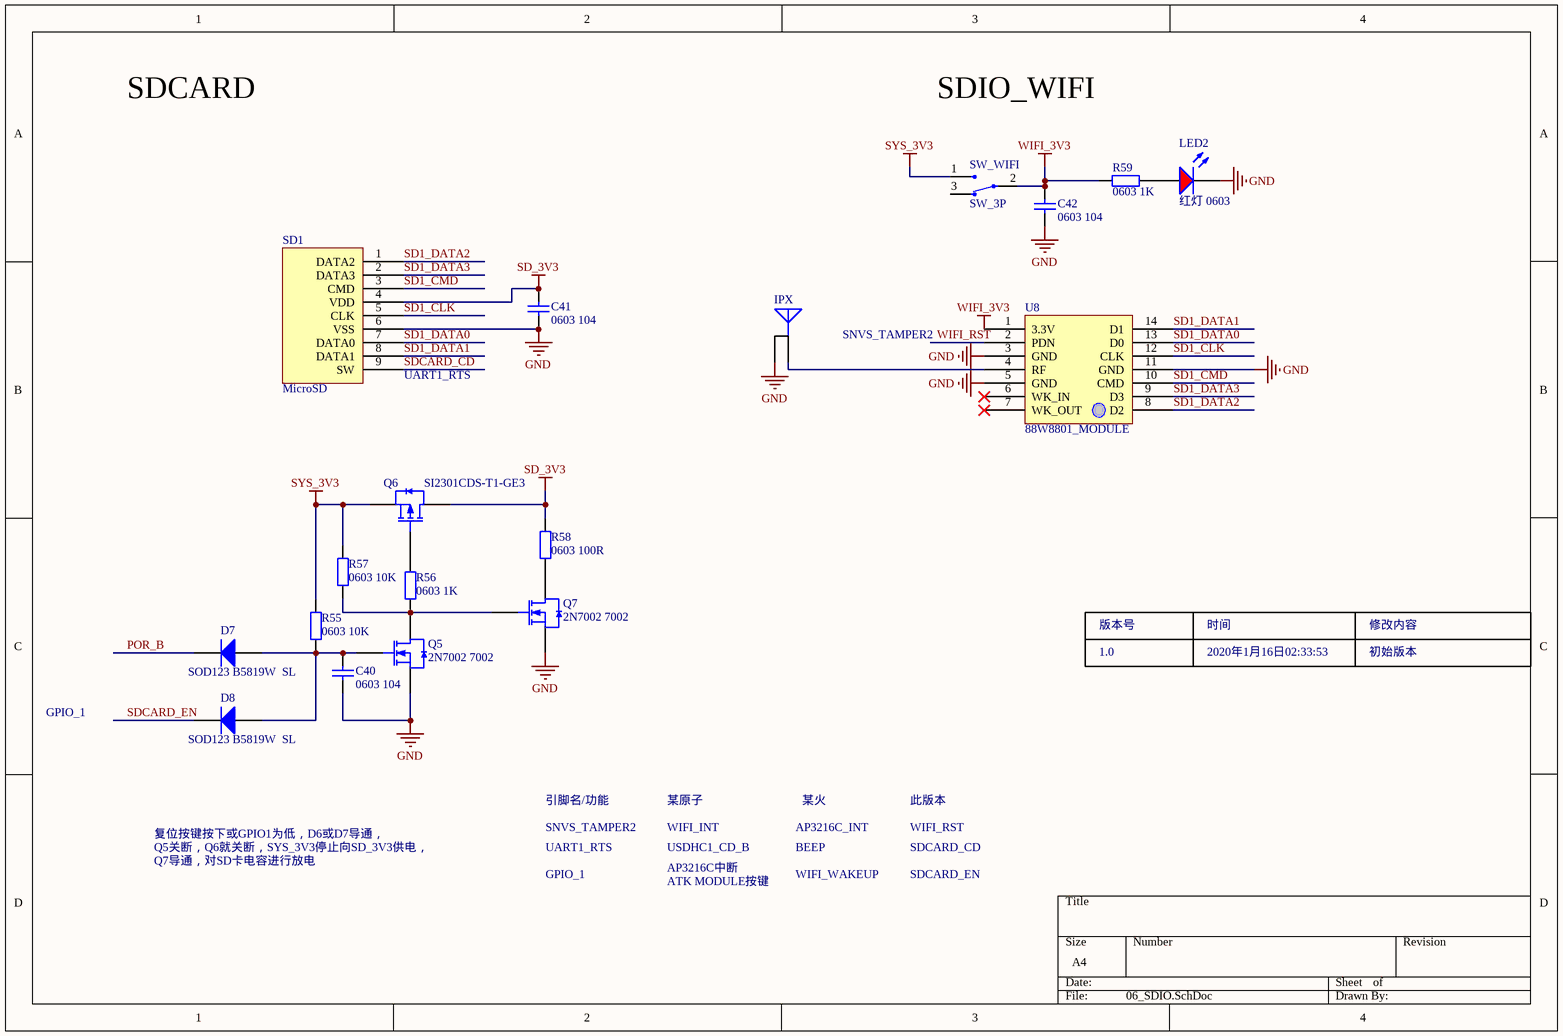
[diagram p5: 06_SDIO.SchDoc]

### Parts
C40  0603 104  [LC-0603_C]
C41  0603 104  [LC-0603_C]
C42  0603 104  [LC-0603_C]
D7  SOD123 B5819W  SL  [LC-SOD-123]
D8  SOD123 B5819W  SL  [LC-SOD-123]
IPX  (no value)  [IPX]
LED2  红灯 0603  [LC-0603_LED_S1]
Q5  2N7002 7002  [LC-SOT-23(SOT-23-3)]
Q6  SI2301CDS-T1-GE3  [LC-SOT-23(SOT-23-3)]
Q7  2N7002 7002  [LC-SOT-23(SOT-23-3)]
R55  0603 10K  [LC-0603_R]
R56  0603 1K  [LC-0603_R]
R57  0603 10K  [LC-0603_R]
R58  0603 100R  [LC-0603_R]
R59  0603 1K  [LC-0603_R]
SD1  MicroSD  [MICROSD_PUSH]
SW_WIFI  SW_3P  [SW_3P]
U8  88W8801_MODULE  [88W8801_MODULE]

### Nets
GND: C40.2 C41.2 C42.2 IPX.2(GND) LED2.K Q5.2(S) Q7.2(S) SD1.6(VSS) U8.3(GND) U8.5(GND) U8.11(GND)
SD_3V3: C41.1 Q6.3(D) R58.1 SD1.4(VDD)
SYS_3V3: Q6.2(S) R55.1 R57.1 SW_WIFI.1
WIFI_3V3: C42.1 R59.1 SW_WIFI.2 U8.1(3.3V)
POR_B: D7.2(K)
SD1_CLK: SD1.5(CLK) U8.12(CLK)
SD1_CMD: SD1.3(CMD) U8.10(CMD)
SD1_DATA0: SD1.7(DATA0) U8.13(D0)
SD1_DATA1: SD1.8(DATA1) U8.14(D1)
SD1_DATA2: SD1.1(DATA2) U8.8(D2)
SD1_DATA3: SD1.2(DATA3) U8.9(D3)
SDCARD_CD: SD1.9(SW)
SDCARD_EN: D8.2(K)  [project net GPIO_1]
WIFI_RST: U8.2(PDN)  [project net SNVS_TAMPER2]
NetC40_1: C40.1 D7.1(A) D8.1(A) Q5.1(G) R55.2
NetIPX_1: IPX.1(RF) U8.4(RF)
NetLED2_A: LED2.A R59.2
NetQ5_3: Q5.3(D) Q7.1(G) R56.2 R57.2
NetQ6_1: Q6.1(G) R56.1
NetQ7_3: Q7.3(D) R58.2

Not connected (* = marked no-connect by the designer): SW_WIFI 3; U8 6(WK_IN)* 7(WK_OUT)*

### Notes on the sheet
- SDCARD
- SDIO_WIFI
- (near SD1) UART1_RTS
- SNVS_TAMPER2
- 版本号
- 1.0
- 2020年1月16日02:33:53
- 时间
- 修改内容
- 初始版本
- GPIO_1
- 复位按键按下或GPIO1为低，D6或D7导通，
- Q5关断，Q6就关断，SYS_3V3停止向SD_3V3供电，
- 引脚名/功能
- UART1_RTS
- WIFI_INT
- 某原子
- USDHC1_CD_B
- AP3216C_INT
- BEEP
- 某火
- 此版本
- WIFI_RST
- SDCARD_CD
- Q7导通，对SD卡电容进行放电
- AP3216C中断
- ATK MODULE按键
- WIFI_WAKEUP
- SDCARD_EN

### Library data of the parts
C40-C42 = 0603 1.5nF (152) 10% 50V: 贴片电容; ComponentLink1Description: 供应商链接; ComponentLink1URL: http://www.szlcsc.com/product/details_1947.html; Package: 0603; Supplier: LC; SuppliersPartNumber: C1595
D7 D8 = SOD-123 B5819W  SL: 肖特基二极管; ComponentLink1Description: 供应商链接; ComponentLink1URL: http://www.szlcsc.com/product/details_9093.html; Package: SOD-123; Supplier: LC; SuppliersPartNumber: C8598
IPX = RF_ANT
LED2 = 0603 红灯: 发光二极管; ComponentLink1Description: 供应商链接; ComponentLink1URL: http://www.szlcsc.com/product/details_2659.html; Package: 0603; Supplier: LC; SuppliersPartNumber: C2286
Q5 Q7 = 2N7002 7002: MOS(场效应管); ComponentLink1Description: 供应商链接; ComponentLink1URL: http://www.szlcsc.com/product/details_9040.html; Package: SOT-23(SOT-23-3); Supplier: LC; SuppliersPartNumber: C8545
Q6 = SI2301CDS-T1-GE3: MOS(场效应管); ComponentLink1Description: 供应商链接; ComponentLink1URL: http://www.szlcsc.com/product/details_11030.html; Package: SOT-23(SOT-23-3); Supplier: LC; SuppliersPartNumber: C10487
R55-R59 = 0603 1.1KΩ (1101) 1%: 贴片电阻; ComponentLink1Description: 供应商链接; ComponentLink1URL: http://www.szlcsc.com/product/details_23491.html; Package: 0603; Supplier: LC; SuppliersPartNumber: C22764

## Sheet 07_AUDIO.SchDoc
size A4
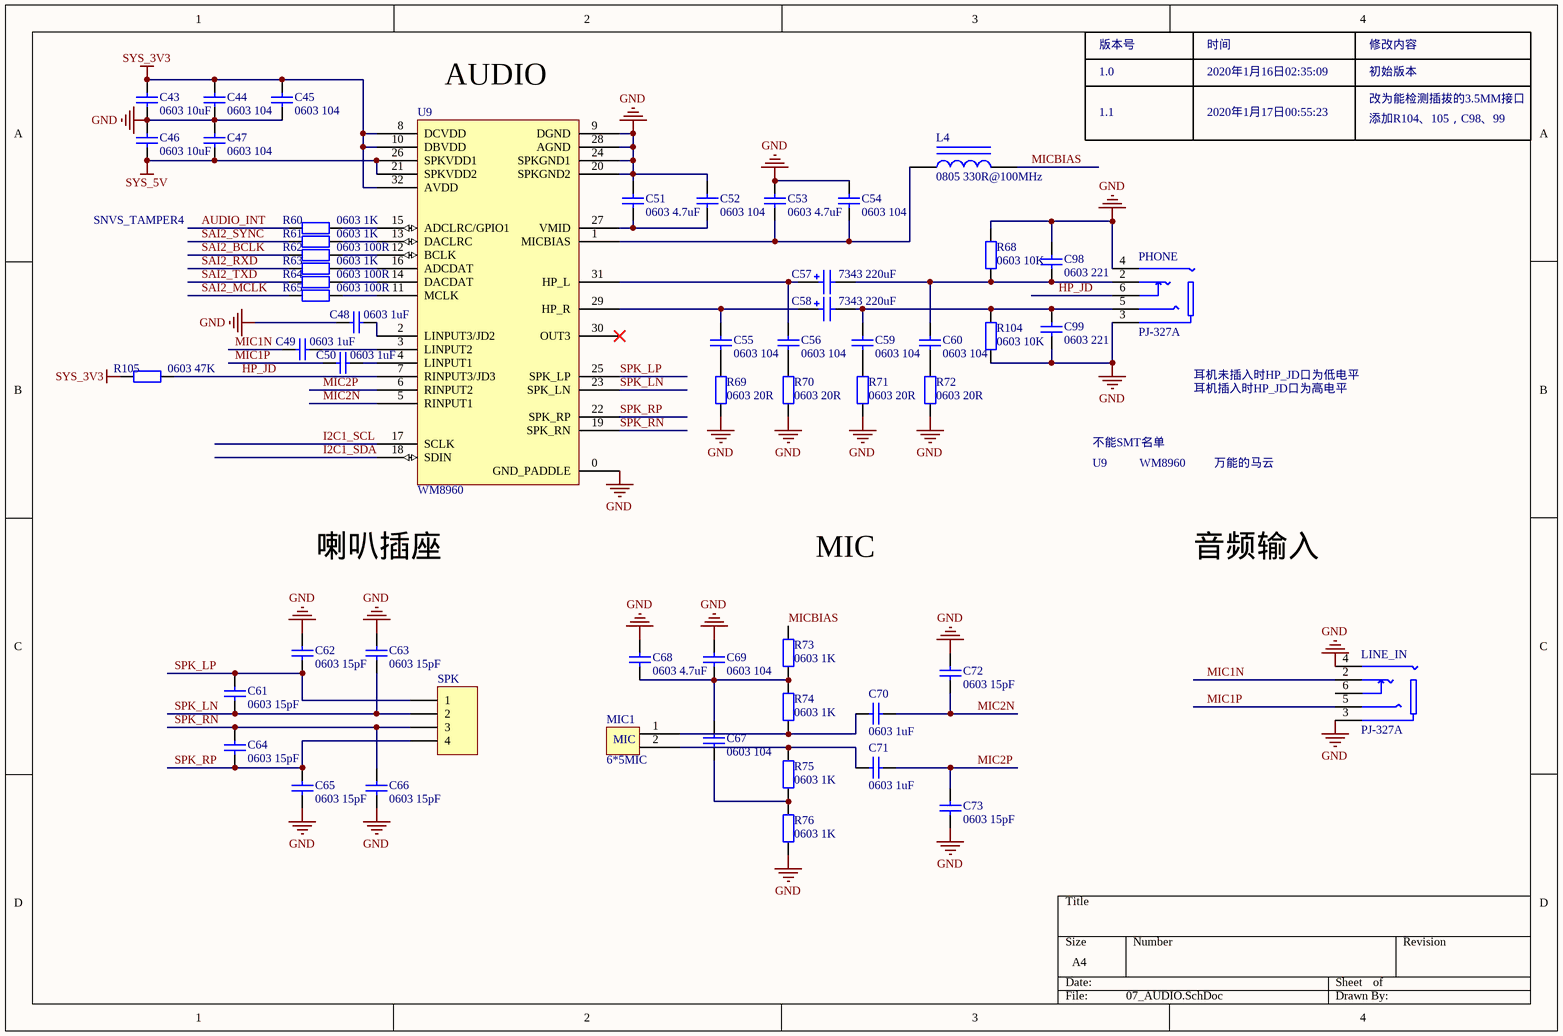
[diagram p6: 07_AUDIO.SchDoc]

### Parts
C43  0603 10uF  [LC-0603_C]
C44  0603 104  [LC-0603_C]
C45  0603 104  [LC-0603_C]
C46  0603 10uF  [LC-0603_C]
C47  0603 104  [LC-0603_C]
C48  0603 1uF  [LC-0603_C]
C49  0603 1uF  [LC-0603_C]
C50  0603 1uF  [LC-0603_C]
C51  0603 4.7uF  [LC-0603_C]
C52  0603 104  [LC-0603_C]
C53  0603 4.7uF  [LC-0603_C]
C54  0603 104  [LC-0603_C]
C55  0603 104  [LC-0603_C]
C56  0603 104  [LC-0603_C]
C57  7343 220uF  [Ta7343]
C58  7343 220uF  [Ta7343]
C59  0603 104  [LC-0603_C]
C60  0603 104  [LC-0603_C]
C61  0603 15pF  [LC-0603_C]
C62  0603 15pF  [LC-0603_C]
C63  0603 15pF  [LC-0603_C]
C64  0603 15pF  [LC-0603_C]
C65  0603 15pF  [LC-0603_C]
C66  0603 15pF  [LC-0603_C]
C67  0603 104  [LC-0603_C]
C68  0603 4.7uF  [LC-0603_C]
C69  0603 104  [LC-0603_C]
C70  0603 1uF  [LC-0603_C]
C71  0603 1uF  [LC-0603_C]
C72  0603 15pF  [LC-0603_C]
C73  0603 15pF  [LC-0603_C]
C98  0603 221  [LC-0603_C]
C99  0603 221  [LC-0603_C]
L4  0805 330R@100MHz  [LC-0805_L]
LINE_IN  PJ-327A  [PJ-327A]
MIC1  6*5MIC  [6*5MIC]
PHONE  PJ-327A  [PJ-327A]
R60  0603 1K  [LC-0603_R]
R61  0603 1K  [LC-0603_R]
R62  0603 100R  [LC-0603_R]
R63  0603 1K  [LC-0603_R]
R64  0603 100R  [LC-0603_R]
R65  0603 100R  [LC-0603_R]
R68  0603 10K  [LC-0603_R]
R69  0603 20R  [LC-0603_R]
R70  0603 20R  [LC-0603_R]
R71  0603 20R  [LC-0603_R]
R72  0603 20R  [LC-0603_R]
R73  0603 1K  [LC-0603_R]
R74  0603 1K  [LC-0603_R]
R75  0603 1K  [LC-0603_R]
R76  0603 1K  [LC-0603_R]
R104  0603 10K  [LC-0603_R]
R105  0603 47K  [LC-0603_R]
SPK  (no value)  [HDR1X4]
U9  WM8960  [LC-QFN-32_5x5x05P]

### Nets
GND: C43.1 C44.1 C45.1 C46.2 C47.2 C48.2 C51.1 C52.1 C53.1 C54.1 C62.1 C63.1 C65.1 C66.1 C68.1 C69.1 C72.2 C73.1 C98.1 C99.2 LINE_IN.3 LINE_IN.4 PHONE.3 PHONE.4 R68.1 R69.2 R70.2 R71.2 R72.2 R76.2 R104.1 U9.0(GND_PADDLE) U9.9(DGND) U9.20(SPKGND2) U9.24(SPKGND1) U9.28(AGND)
SYS_3V3: C43.2 C44.2 C45.2 R105.1 U9.8(DCVDD) U9.10(DBVDD) U9.32(AVDD)
SYS_5V: C46.1 C47.1 U9.21(SPKVDD2) U9.26(SPKVDD1)
AUDIO_INT: R60.1
HP_JD: PHONE.6 R105.2 U9.7(RINPUT3/JD3)
I2C1_SCL: U9.17(SCLK)
I2C1_SDA: U9.18(SDIN)
MIC1N: C49.2 LINE_IN.2
MIC1P: C50.2 LINE_IN.5
MIC2N: C70.2 C72.1 U9.5(RINPUT1)
MIC2P: C71.2 C73.2 U9.6(RINPUT2)
MICBIAS: L4.2 R73.1
SAI2_BCLK: R62.1  [project net JTAG_TDI]
SAI2_MCLK: R65.1  [project net JTAG_TMS]
SAI2_RXD: R63.1  [project net JTAG_TCK]
SAI2_SYNC: R61.1  [project net JTAG_TDO]
SAI2_TXD: R64.1  [project net JTAG_nTRST]
SPK_LN: C61.2 C63.2 SPK.2 U9.23(SPK_LN)
SPK_LP: C61.1 C62.2 SPK.1 U9.25(SPK_LP)
SPK_RN: C64.2 C66.2 SPK.3 U9.19(SPK_RN)
SPK_RP: C64.1 C65.2 SPK.4 U9.22(SPK_RP)
NetC48_1: C48.1 U9.2(LINPUT3/JD2)
NetC49_1: C49.1 U9.3(LINPUT2)
NetC50_1: C50.1 U9.4(LINPUT1)
NetC51_2: C51.2 C52.2 U9.27(VMID)
NetC53_2: C53.2 C54.2 L4.1 U9.1(MICBIAS)
NetC55_1: C55.1 C58.1 U9.29(HP_R)
NetC55_2: C55.2 R69.1
NetC56_1: C56.1 C57.1 U9.31(HP_L)
NetC56_2: C56.2 R70.1
NetC57_2: C57.2 C60.1 C98.2 PHONE.2 R68.2
NetC58_2: C58.2 C59.1 C99.1 PHONE.5 R104.2
NetC59_2: C59.2 R71.1
NetC60_2: C60.2 R72.1
NetC67_1: C67.1 R75.2 R76.1
NetC67_2: C67.2 C68.2 C69.2 R73.2 R74.1
NetC70_1: C70.1 MIC1.1 R74.2
NetC71_1: C71.1 MIC1.2 R75.1
NetR60_2: R60.2 U9.15(ADCLRC/GPIO1)
NetR61_2: R61.2 U9.13(DACLRC)
NetR62_2: R62.2 U9.12(BCLK)
NetR63_2: R63.2 U9.16(ADCDAT)
NetR64_2: R64.2 U9.14(DACDAT)
NetR65_2: R65.2 U9.11(MCLK)

Not connected (* = marked no-connect by the designer): LINE_IN 6; U9 30(OUT3)*

### Notes on the sheet
- (near U9) AUDIO
- 版本号
- 1.0
- 1.1
- 2020年1月16日02:35:09
- 时间
- 2020年1月17日00:55:23
- 修改内容
- 初始版本
- 改为能检测插拔的3.5MM接口
- 添加R104、105，C98、99
- SNVS_TAMPER4
- 耳机未插入时HP_JD口为低电平
- 不能SMT名单
- 耳机插入时HP_JD口为高电平
- U9
- WM8960
- 万能的马云
- 喇叭插座
- MIC
- 音频输入
- (in symbol 6*5MIC) MIC

### Library data of the parts
C43-C56 C59-C73 C98 C99 = 0603 1.5nF (152) 10% 50V: 贴片电容; ComponentLink1Description: 供应商链接; ComponentLink1URL: http://www.szlcsc.com/product/details_1947.html; Package: 0603; Supplier: LC; SuppliersPartNumber: C1595
C57 C58 = CAP1
L4 = 0805 1uH 10%: 贴片电感; ComponentLink1URL: http://www.szlcsc.com/product/details_1394.html; Package: 0805; Supplier: LC; SuppliersPartNumber: C1042
R60-R65 R68-R76 R104 R105 = 0603 1.1KΩ (1101) 1%: 贴片电阻; ComponentLink1Description: 供应商链接; ComponentLink1URL: http://www.szlcsc.com/product/details_23491.html; Package: 0603; Supplier: LC; SuppliersPartNumber: C22764
SPK = Header 4: Header, 4-Pin; LatestRevisionDate: 17-Jul-2002; LatestRevisionNote: Re-released for DXP Platform.; Publisher: Altium Limited

## Sheet 08_PERIPHERAL.SchDoc
size A4
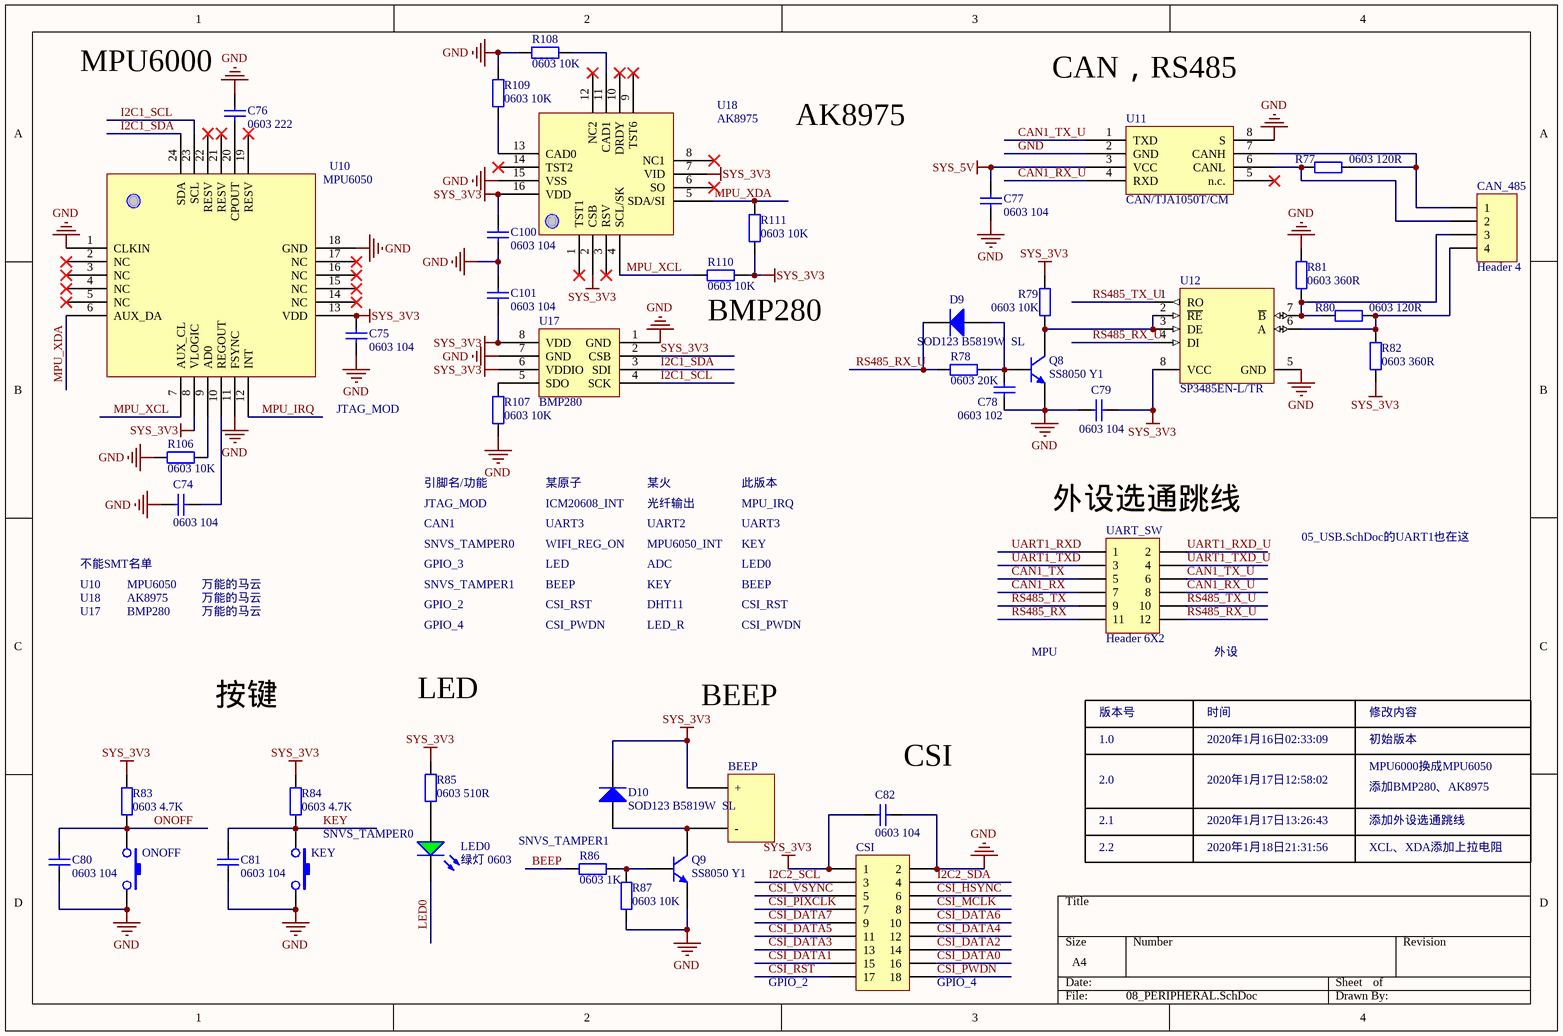
[diagram p7: 08_PERIPHERAL.SchDoc]

### Parts
BEEP  (no value)  [BEEP]
C74  0603 104  [LC-0603_C]
C75  0603 104  [LC-0603_C]
C76  0603 222  [LC-0603_C]
C77  0603 104  [LC-0603_C]
C78  0603 102  [LC-0603_C]
C79  0603 104  [LC-0603_C]
C80  0603 104  [LC-0603_C]
C81  0603 104  [LC-0603_C]
C82  0603 104  [LC-0603_C]
C100  0603 104  [LC-0603_C]
C101  0603 104  [LC-0603_C]
CAN_485  Header 4  [HDR1X4]
CSI  (no value)  [HDR2X9]
D9  SOD123 B5819W  SL  [LC-SOD-123]
D10  SOD123 B5819W  SL  [LC-SOD-123]
KEY  (no value)  [KEY2]
LED0  绿灯 0603  [LC-0603_LED_S1]
ONOFF  (no value)  [KEY2]
Q8  SS8050 Y1  [LC-SOT-23(SOT-23-3)]
Q9  SS8050 Y1  [LC-SOT-23(SOT-23-3)]
R77  0603 120R  [LC-0603_R]
R78  0603 20K  [LC-0603_R]
R79  0603 10K  [LC-0603_R]
R80  0603 120R  [LC-0603_R]
R81  0603 360R  [LC-0603_R]
R82  0603 360R  [LC-0603_R]
R83  0603 4.7K  [LC-0603_R]
R84  0603 4.7K  [LC-0603_R]
R85  0603 510R  [LC-0603_R]
R86  0603 1K  [LC-0603_R]
R87  0603 10K  [LC-0603_R]
R106  0603 10K  [LC-0603_R]
R107  0603 10K  [LC-0603_R]
R108  0603 10K  [LC-0603_R]
R109  0603 10K  [LC-0603_R]
R110  0603 10K  [LC-0603_R]
R111  0603 10K  [LC-0603_R]
U10  MPU6050  [QFN-24_4x4x05P]
U11  CAN/TJA1050T/CM  [LC-SOIC-8_150mil]
U12  SP3485EN-L/TR  [LC-SOIC-8_150mil]
U17  BMP280  [BMP280]
U18  AK8975  [QFN16(4mm)]
UART_SW  Header 6X2  [HDR2X6]

### Nets
GND: C74.1 C75.1 C76.2 C77.1 C78.2 C79.1 C80.1 C81.1 C82.1 C100.2 C101.1 CSI.2 KEY.2 ONOFF.2 Q8.2(E) Q9.2(E) R81.2 R87.2 R106.1 R107.1 R108.2 R109.1 U10.1(CLKIN) U10.11(FSYNC) U10.18(GND) U11.2(GND) U11.8(S) U12.5(GND) U17.1(GND) U17.7(GND) U18.15(VSS)
SYS_3V3: BEEP.+ C75.2 C79.2 C82.2 C100.1 C101.2 CSI.1 D10.2(K) R79.1 R82.1 R83.2 R84.2 R85.2 R110.2 R111.2 U10.8(VLOGIC) U10.13(VDD) U12.8(VCC) U17.2(CSB) U17.6(VDDIO) U17.8(VDD) U18.2(CSB) U18.16(VDD)
SYS_5V: C77.2 U11.3(VCC)
BEEP: R86.2
CAN1_RX: UART_SW.7
CAN1_RX_U: U11.4(RXD) UART_SW.8
CAN1_TX: UART_SW.5
CAN1_TX_U: U11.1(TXD) UART_SW.6
CSI_DATA0: CSI.16
CSI_DATA1: CSI.15
CSI_DATA2: CSI.14
CSI_DATA3: CSI.13
CSI_DATA4: CSI.12
CSI_DATA5: CSI.11
CSI_DATA6: CSI.10
CSI_DATA7: CSI.9
CSI_HSYNC: CSI.6
CSI_MCLK: CSI.8
CSI_PIXCLK: CSI.7
CSI_PWDN: CSI.18
CSI_RST: CSI.17
CSI_VSYNC: CSI.5
I2C1_SCL: U10.23(SCL) U17.4(SCK)
I2C1_SDA: U10.24(SDA) U17.3(SDI)
I2C2_SCL: CSI.3
I2C2_SDA: CSI.4
KEY: C81.2 KEY.1 R84.1
LED0: LED0.K  [project net GPIO_3]
MPU_IRQ: U10.12(INT)  [project net JTAG_MOD]
MPU_XCL: R110.1 U10.7(AUX_CL) U18.4(SCL/SK)
MPU_XDA: R111.1 U10.6(AUX_DA) U18.5(SDA/SI)
ONOFF: C80.2 ONOFF.1 R83.1
RS485_RX: UART_SW.11
RS485_RX_U: D9.2(K) R78.2 U12.4(DI) UART_SW.12
RS485_TX: UART_SW.9
RS485_TX_U: U12.1(RO) UART_SW.10
UART1_RXD: UART_SW.1
UART1_RXD_U: UART_SW.2
UART1_TXD: UART_SW.3
UART1_TXD_U: UART_SW.4
NetBEEP_-: BEEP.- D10.1(A) Q9.3(C)
NetC74_2: C74.2 U10.10(REGOUT)
NetC76_1: C76.1 U10.20(CPOUT)
NetC78_1: C78.1 D9.1(A) Q8.1(B) R78.1
NetCAN_485_1: CAN_485.1 R77.2 U11.7(CANH)
NetCAN_485_2: CAN_485.2 R77.1 U11.6(CANL)
NetCAN_485_3: CAN_485.3 R80.1 R81.1 U12.7(~{B})
NetCAN_485_4: CAN_485.4 R80.2 R82.2 U12.6(A)
NetLED0_A: LED0.A R85.1
NetQ8_3: Q8.3(C) R79.2 U12.2(~{RE}) U12.3(DE)
NetQ9_1: Q9.1(B) R86.1 R87.1
NetR106_2: R106.2 U10.9(AD0)
NetR107_2: R107.2 U17.5(SDO)
NetR108_1: R108.1 U18.11(CAD1)
NetR109_2: R109.2 U18.13(CAD0)

Not connected (* = marked no-connect by the designer): U10 2(NC)* 3(NC)* 4(NC)* 5(NC)* 14(NC)* 15(NC)* 16(NC)* 17(NC)* 19(RESV)* 21(RESV)* 22(RESV)*; U11 5(n.c.)*; U18 1(TST1)* 3(RSV)* 6(SO)* 7(VID) 8(NC1)* 9(TST6)* 10(DRDY)* 12(NC2)* 14(TST2)*

### Notes on the sheet
- (near C76) MPU6000
- CAN，RS485
- AK8975
- (near R110) BMP280
- (near U10) JTAG_MOD
- JTAG_MOD
- 引脚名/功能
- 某原子
- ICM20608_INT
- 某火
- 光纤输出
- 此版本
- MPU_IRQ
- (near UART_SW) 外设选通跳线
- 不能SMT名单
- CAN1
- SNVS_TAMPER0
- GPIO_3
- UART3
- WIFI_REG_ON
- LED
- UART2
- MPU6050_INT
- ADC
- KEY
- LED0
- 05_USB.SchDoc的UART1也在这
- U10
- U18
- U17
- MPU6050
- BMP280
- 万能的马云
- SNVS_TAMPER1
- GPIO_2
- GPIO_4
- BEEP
- CSI_RST
- CSI_PWDN
- DHT11
- LED_R
- MPU
- 外设
- 按键
- 版本号
- 时间
- 修改内容
- (near C82) CSI
- 1.0
- 2.0
- 2020年1月16日02:33:09
- 2020年1月17日12:58:02
- 初始版本
- MPU6000换成MPU6050
- 添加BMP280、AK8975
- (near R86) SNVS_TAMPER1
- 2.1
- 2.2
- 2020年1月17日13:26:43
- 2020年1月18日21:31:56
- 添加外设选通跳线
- XCL、XDA添加上拉电阻
- (near CSI) GPIO_2
- (near CSI) GPIO_4
- Labels drawn without touching a wire or pin: SYS_3V3

### Library data of the parts
BEEP = BEEP
C74-C82 C100 C101 = 0603 1.5nF (152) 10% 50V: 贴片电容; ComponentLink1Description: 供应商链接; ComponentLink1URL: http://www.szlcsc.com/product/details_1947.html; Package: 0603; Supplier: LC; SuppliersPartNumber: C1595
CAN_485 = Header 4: Header, 4-Pin; LatestRevisionDate: 17-Jul-2002; LatestRevisionNote: Re-released for DXP Platform.; Publisher: Altium Limited
CSI = Header 9X2: Header, 9-Pin, Dual row; LatestRevisionDate: 17-Jul-2002; LatestRevisionNote: Re-released for DXP Platform.; Publisher: Altium Limited
D9 D10 = SOD-123 B5819W  SL: 肖特基二极管; ComponentLink1Description: 供应商链接; ComponentLink1URL: http://www.szlcsc.com/product/details_9093.html; Package: SOD-123; Supplier: LC; SuppliersPartNumber: C8598
KEY ONOFF = KEY
LED0 = 0603 绿灯: 发光二极管; ComponentLink1Description: 供应商链接; ComponentLink1URL: http://www.szlcsc.com/product/details_73152.html; Package: 0603; Supplier: LC; SuppliersPartNumber: C72043
Q8 Q9 = SOT-23 SS8050 Y1: 三极管; ComponentLink1Description: 供应商链接; ComponentLink1URL: http://www.szlcsc.com/product/details_2507.html; Package: SOT-23; Supplier: LC; SuppliersPartNumber: C2150
R77-R87 R106-R111 = 0603 1.1KΩ (1101) 1%: 贴片电阻; ComponentLink1Description: 供应商链接; ComponentLink1URL: http://www.szlcsc.com/product/details_23491.html; Package: 0603; Supplier: LC; SuppliersPartNumber: C22764
U11 = CAN/TJA1050T/CM: CAN; ComponentLink1Description: 供应商链接; ComponentLink1URL: http://www.szlcsc.com/product/details_7424.html; Package: SOIC-8_150mil; Supplier: LC; SuppliersPartNumber: C6952
U12 = SP3485EN-L/TR: RS-485/RS-422; ComponentLink1Description: 供应商链接; ComponentLink1URL: http://www.szlcsc.com/product/details_9482.html; Package: SOIC-8; Supplier: LC; SuppliersPartNumber: C8963
UART_SW = Header 6X2: Header, 6-Pin, Dual row; LatestRevisionDate: 17-Jul-2002; LatestRevisionNote: Re-released for DXP Platform.; Publisher: Altium Limited

## Sheet 09_RGB_LCD.SchDoc
size A4
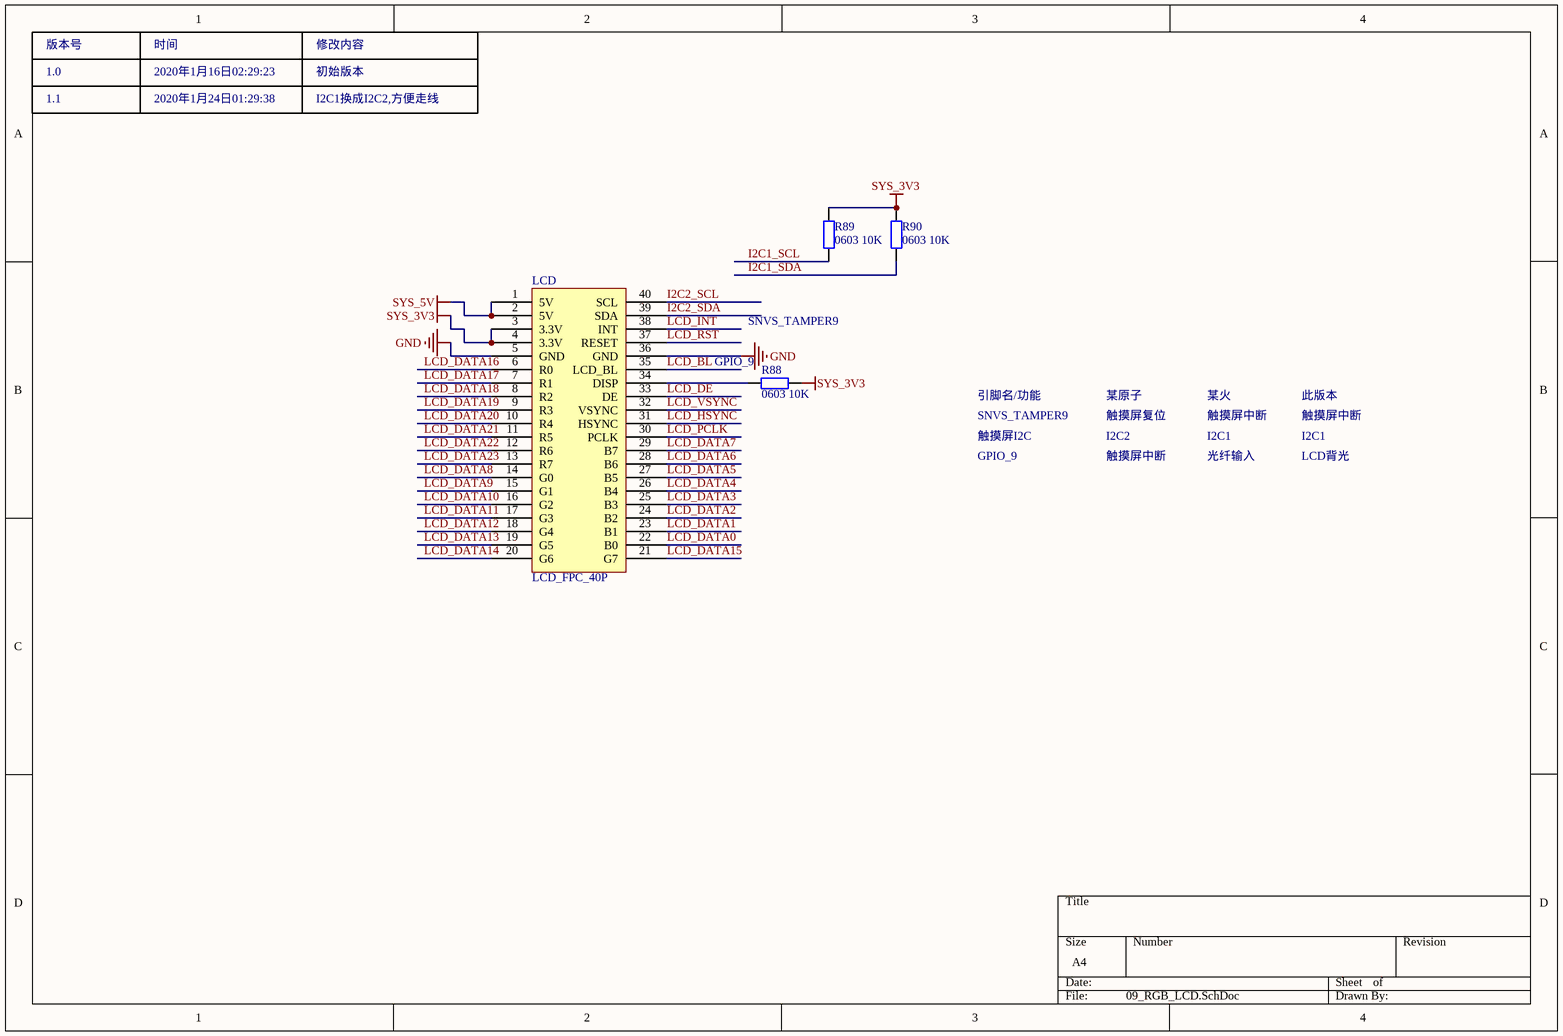
[diagram p8: 09_RGB_LCD.SchDoc]

### Parts
LCD  LCD_FPC_40P  [FPC40P_P]
R88  0603 10K  [LC-0603_R]
R89  0603 10K  [LC-0603_R]
R90  0603 10K  [LC-0603_R]

### Nets
GND: LCD.5(GND) LCD.36(GND)
SYS_3V3: LCD.3(3.3V) LCD.4(3.3V) R88.2 R89.2 R90.2
SYS_5V: LCD.1(5V) LCD.2(5V)
I2C1_SCL: R89.1
I2C1_SDA: R90.1
I2C2_SCL: LCD.40(SCL)
I2C2_SDA: LCD.39(SDA)
LCD_BL: LCD.35(LCD_BL)  [project net GPIO_9]
LCD_DATA0: LCD.22(B0)
LCD_DATA1: LCD.23(B1)
LCD_DATA2: LCD.24(B2)
LCD_DATA3: LCD.25(B3)
LCD_DATA4: LCD.26(B4)
LCD_DATA5: LCD.27(B5)
LCD_DATA6: LCD.28(B6)
LCD_DATA7: LCD.29(B7)
LCD_DATA8: LCD.14(G0)
LCD_DATA9: LCD.15(G1)
LCD_DATA10: LCD.16(G2)
LCD_DATA11: LCD.17(G3)
LCD_DATA12: LCD.18(G4)
LCD_DATA13: LCD.19(G5)
LCD_DATA14: LCD.20(G6)
LCD_DATA15: LCD.21(G7)
LCD_DATA16: LCD.6(R0)
LCD_DATA17: LCD.7(R1)
LCD_DATA18: LCD.8(R2)
LCD_DATA19: LCD.9(R3)
LCD_DATA20: LCD.10(R4)
LCD_DATA21: LCD.11(R5)
LCD_DATA22: LCD.12(R6)
LCD_DATA23: LCD.13(R7)
LCD_DE: LCD.33(DE)
LCD_HSYNC: LCD.31(HSYNC)
LCD_INT: LCD.38(INT)
LCD_PCLK: LCD.30(PCLK)
LCD_RST: LCD.37(RESET)
LCD_VSYNC: LCD.32(VSYNC)
NetLCD_34: LCD.34(DISP) R88.1

### Notes on the sheet
- 版本号
- 1.0
- 1.1
- 2020年1月16日02:29:23
- 时间
- 2020年1月24日01:29:38
- 修改内容
- 初始版本
- I2C1换成I2C2,方便走线
- (near R88) GPIO_9
- SNVS_TAMPER9
- 引脚名/功能
- 触摸屏I2C
- 某原子
- 触摸屏复位
- I2C2
- 某火
- 触摸屏中断
- I2C1
- 此版本
- GPIO_9
- 光纤输入
- LCD背光

### Library data of the parts
R88-R90 = 0603 1.1KΩ (1101) 1%: 贴片电阻; ComponentLink1Description: 供应商链接; ComponentLink1URL: http://www.szlcsc.com/product/details_23491.html; Package: 0603; Supplier: LC; SuppliersPartNumber: C22764

## Sheet 10_HDMI.SchDoc
size A4
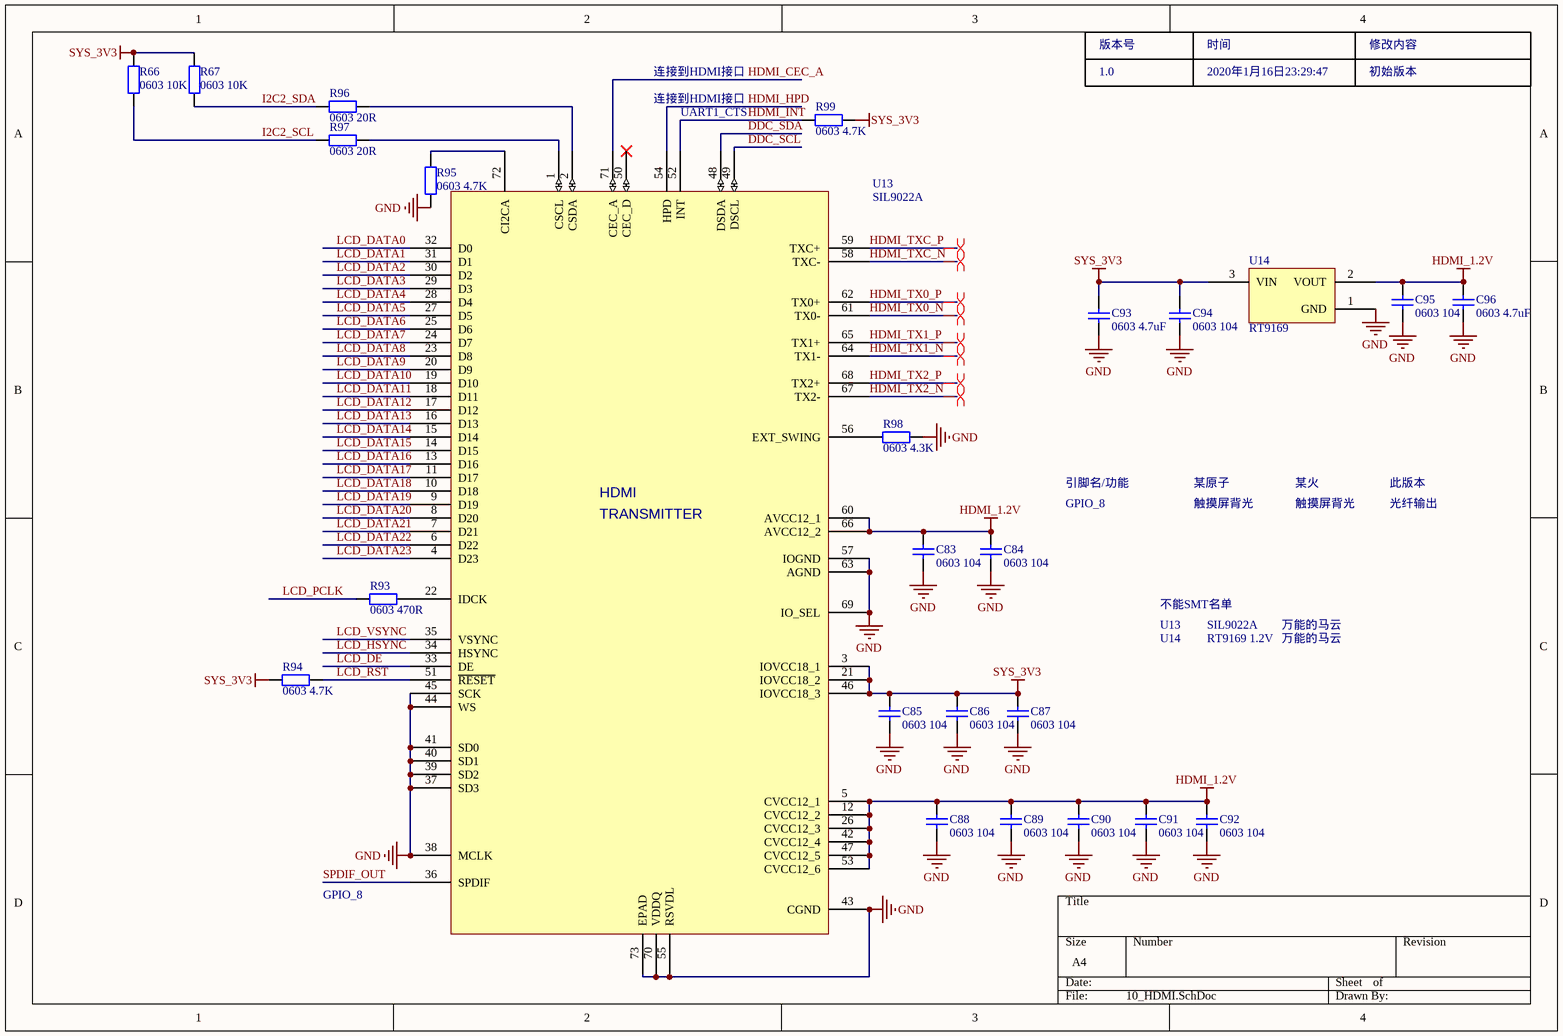
[diagram p9: 10_HDMI.SchDoc]

### Parts
C83  0603 104  [LC-0603_C]
C84  0603 104  [LC-0603_C]
C85  0603 104  [LC-0603_C]
C86  0603 104  [LC-0603_C]
C87  0603 104  [LC-0603_C]
C88  0603 104  [LC-0603_C]
C89  0603 104  [LC-0603_C]
C90  0603 104  [LC-0603_C]
C91  0603 104  [LC-0603_C]
C92  0603 104  [LC-0603_C]
C93  0603 4.7uF  [LC-0603_C]
C94  0603 104  [LC-0603_C]
C95  0603 104  [LC-0603_C]
C96  0603 4.7uF  [LC-0603_C]
R66  0603 10K  [LC-0603_R]
R67  0603 10K  [LC-0603_R]
R93  0603 470R  [LC-0603_R]
R94  0603 4.7K  [LC-0603_R]
R95  0603 4.7K  [LC-0603_R]
R96  0603 20R  [LC-0603_R]
R97  0603 20R  [LC-0603_R]
R98  0603 4.3K  [LC-0603_R]
R99  0603 4.7K  [LC-0603_R]
U13  SIL9022A  [QFN72_10X10]
U14  RT9169  [LC-SOT-23(SOT-23-3)]

### Nets
GND: C83.2 C84.2 C85.2 C86.2 C87.2 C88.2 C89.2 C90.2 C91.2 C92.2 C93.2 C94.2 C95.2 C96.2 R95.2 R98.2 U13.37(SD3) U13.38(MCLK) U13.39(SD2) U13.40(SD1) U13.41(SD0) U13.43(CGND) U13.44(WS) U13.45(SCK) U13.55(RSVDL) U13.57(IOGND) U13.63(AGND) U13.69(IO_SEL) U13.70(VDDQ) U13.73(EPAD) U14.1(GND)
HDMI_1.2V: C83.1 C84.1 C88.1 C89.1 C90.1 C91.1 C92.1 C95.1 C96.1 U13.5(CVCC12_1) U13.12(CVCC12_2) U13.26(CVCC12_3) U13.42(CVCC12_4) U13.47(CVCC12_5) U13.53(CVCC12_6) U13.60(AVCC12_1) U13.66(AVCC12_2) U14.2(VOUT)
SYS_3V3: C85.1 C86.1 C87.1 C93.1 C94.1 R66.2 R67.2 R94.2 R99.2 U13.3(IOVCC18_1) U13.21(IOVCC18_2) U13.46(IOVCC18_3) U14.3(VIN)
DDC_SCL: U13.49(DSCL)
DDC_SDA: U13.48(DSDA)
HDMI_CEC_A: U13.71(CEC_A)
HDMI_HPD: U13.54(HPD)
HDMI_INT: R99.1 U13.52(INT)
HDMI_TX0_N: U13.61(TX0-)
HDMI_TX0_P: U13.62(TX0+)
HDMI_TX1_N: U13.64(TX1-)
HDMI_TX1_P: U13.65(TX1+)
HDMI_TX2_N: U13.67(TX2-)
HDMI_TX2_P: U13.68(TX2+)
HDMI_TXC_N: U13.58(TXC-)
HDMI_TXC_P: U13.59(TXC+)
I2C2_SCL: R66.1 R97.1
I2C2_SDA: R67.1 R96.1
LCD_DATA0: U13.32(D0)
LCD_DATA1: U13.31(D1)
LCD_DATA2: U13.30(D2)
LCD_DATA3: U13.29(D3)
LCD_DATA4: U13.28(D4)
LCD_DATA5: U13.27(D5)
LCD_DATA6: U13.25(D6)
LCD_DATA7: U13.24(D7)
LCD_DATA8: U13.23(D8)
LCD_DATA9: U13.20(D9)
LCD_DATA10: U13.19(D10)
LCD_DATA11: U13.18(D11)
LCD_DATA12: U13.17(D12)
LCD_DATA13: U13.16(D13)
LCD_DATA14: U13.15(D14)
LCD_DATA15: U13.14(D15)
LCD_DATA16: U13.13(D16)
LCD_DATA17: U13.11(D17)
LCD_DATA18: U13.10(D18)
LCD_DATA19: U13.9(D19)
LCD_DATA20: U13.8(D20)
LCD_DATA21: U13.7(D21)
LCD_DATA22: U13.6(D22)
LCD_DATA23: U13.4(D23)
LCD_DE: U13.33(DE)
LCD_HSYNC: U13.34(HSYNC)
LCD_PCLK: R93.2
LCD_RST: R94.1 U13.51(~{RESET})
LCD_VSYNC: U13.35(VSYNC)
SPDIF_OUT: U13.36(SPDIF)  [project net GPIO_8]
NetR93_1: R93.1 U13.22(IDCK)
NetR95_1: R95.1 U13.72(CI2CA)
NetR96_2: R96.2 U13.2(CSDA)
NetR97_2: R97.2 U13.1(CSCL)
NetR98_1: R98.1 U13.56(EXT_SWING)

Not connected (* = marked no-connect by the designer): U13 50(CEC_D)*

### Layout directives
differential pair: HDMI_TX0_N, HDMI_TX0_P, HDMI_TX1_N, HDMI_TX1_P, HDMI_TX2_N, HDMI_TX2_P, HDMI_TXC_N, HDMI_TXC_P

### Notes on the sheet
- 连接到HDMI接口
- UART1_CTS
- 版本号
- 1.0
- 2020年1月16日23:29:47
- 时间
- 修改内容
- 初始版本
- 引脚名/功能
- GPIO_8
- 某原子
- 触摸屏背光
- 某火
- 此版本
- 光纤输出
- U13
- 不能SMT名单
- U14
- SIL9022A
- RT9169 1.2V
- 万能的马云
- (in symbol SIL9022A) HDMI; TRANSMITTER

### Library data of the parts
C83-C96 = 0603 1.5nF (152) 10% 50V: 贴片电容; ComponentLink1Description: 供应商链接; ComponentLink1URL: http://www.szlcsc.com/product/details_1947.html; Package: 0603; Supplier: LC; SuppliersPartNumber: C1595
R66 R67 R93-R99 = 0603 1.1KΩ (1101) 1%: 贴片电阻; ComponentLink1Description: 供应商链接; ComponentLink1URL: http://www.szlcsc.com/product/details_23491.html; Package: 0603; Supplier: LC; SuppliersPartNumber: C22764

## Sheet 11_HDMI_CON.SchDoc
size A4
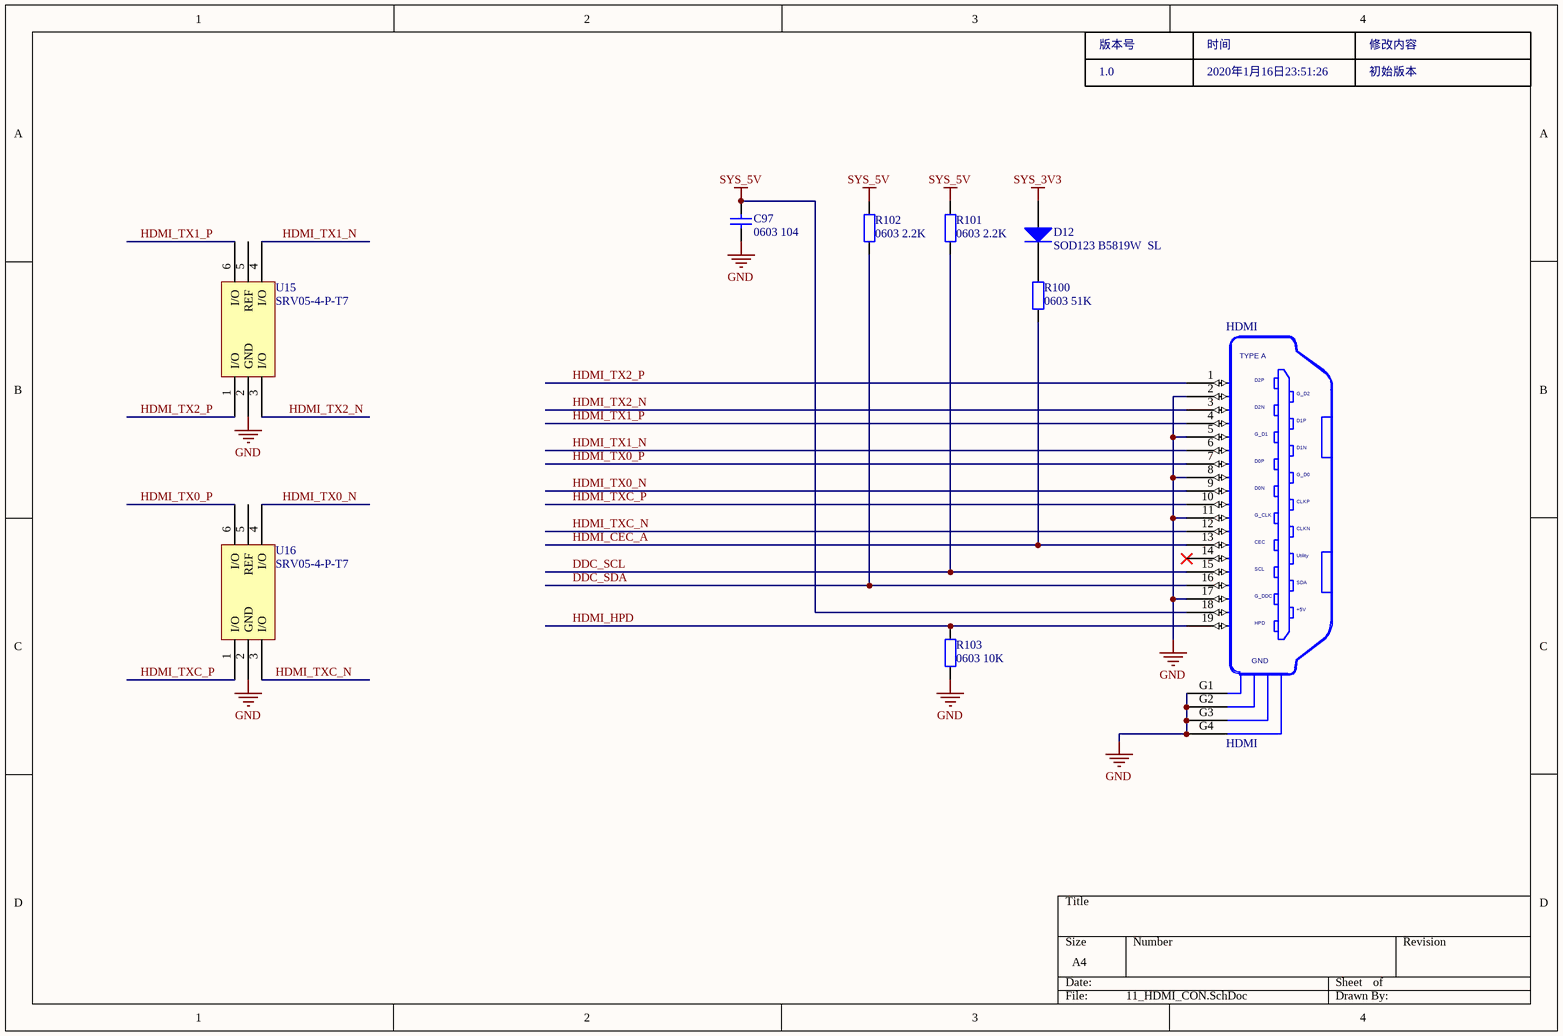
[diagram p10: 11_HDMI_CON.SchDoc]

### Parts
C97  0603 104  [LC-0603_C]
D12  SOD123 B5819W  SL  [LC-SOD-123]
HDMI  HDMI  [HDMI]
R100  0603 51K  [LC-0603_R]
R101  0603 2.2K  [LC-0603_R]
R102  0603 2.2K  [LC-0603_R]
R103  0603 10K  [LC-0603_R]
U15  SRV05-4-P-T7  [LC-SOT-23-6]
U16  SRV05-4-P-T7  [LC-SOT-23-6]

### Nets
GND: C97.2 HDMI.2(D2GND) HDMI.5(D1GND) HDMI.8(D0GND) HDMI.11(CKGND) HDMI.17(DDCGND) HDMI.G1(GND1) HDMI.G2(GND2) HDMI.G3(GND3) HDMI.G4(GND4) R103.1 U15.2(GND) U16.2(GND)
SYS_3V3: D12.1(A)
SYS_5V: C97.1 HDMI.18(+5V) R101.2 R102.2
DDC_SCL: HDMI.15(SCL) R101.1
DDC_SDA: HDMI.16(SDA) R102.1
HDMI_CEC_A: HDMI.13(CEC) R100.1
HDMI_HPD: HDMI.19(HPD) R103.2
HDMI_TX0_N: HDMI.9(D0-) U16.4(I/O)
HDMI_TX0_P: HDMI.7(D0+) U16.6(I/O)
HDMI_TX1_N: HDMI.6(D1-) U15.4(I/O)
HDMI_TX1_P: HDMI.4(D1+) U15.6(I/O)
HDMI_TX2_N: HDMI.3(D2-) U15.3(I/O)
HDMI_TX2_P: HDMI.1(D2+) U15.1(I/O)
HDMI_TXC_N: HDMI.12(CK-) U16.3(I/O)
HDMI_TXC_P: HDMI.10(CK+) U16.1(I/O)
NetD12_2: D12.2(K) R100.2

Not connected (* = marked no-connect by the designer): HDMI 14(UTILITY)*; U15 5(REF); U16 5(REF)

### Notes on the sheet
- 版本号
- 1.0
- 2020年1月16日23:51:26
- 时间
- 修改内容
- 初始版本
- (in symbol HDMI) TYPE A; D2P; G_D2; D2N; D1P; G_D1; D1N; D0P; G_D0; D0N; CLKP; G_CLK; CLKN; Utility; G_DDC; GND

### Library data of the parts
C97 = 0603 1.5nF (152) 10% 50V: 贴片电容; ComponentLink1Description: 供应商链接; ComponentLink1URL: http://www.szlcsc.com/product/details_1947.html; Package: 0603; Supplier: LC; SuppliersPartNumber: C1595
D12 = SOD-123 B5819W  SL: 肖特基二极管; ComponentLink1Description: 供应商链接; ComponentLink1URL: http://www.szlcsc.com/product/details_9093.html; Package: SOD-123; Supplier: LC; SuppliersPartNumber: C8598
R100-R103 = 0603 1.1KΩ (1101) 1%: 贴片电阻; ComponentLink1Description: 供应商链接; ComponentLink1URL: http://www.szlcsc.com/product/details_23491.html; Package: 0603; Supplier: LC; SuppliersPartNumber: C22764
U15 U16 = SRV05-4-P-T7: TVS; ComponentLink1Description: 供应商链接; ComponentLink1URL: http://www.szlcsc.com/product/details_86537.html; Package: SOT-23-6; Supplier: LC; SuppliersPartNumber: C85364

## Sheet 12_IO.SchDoc
size A4
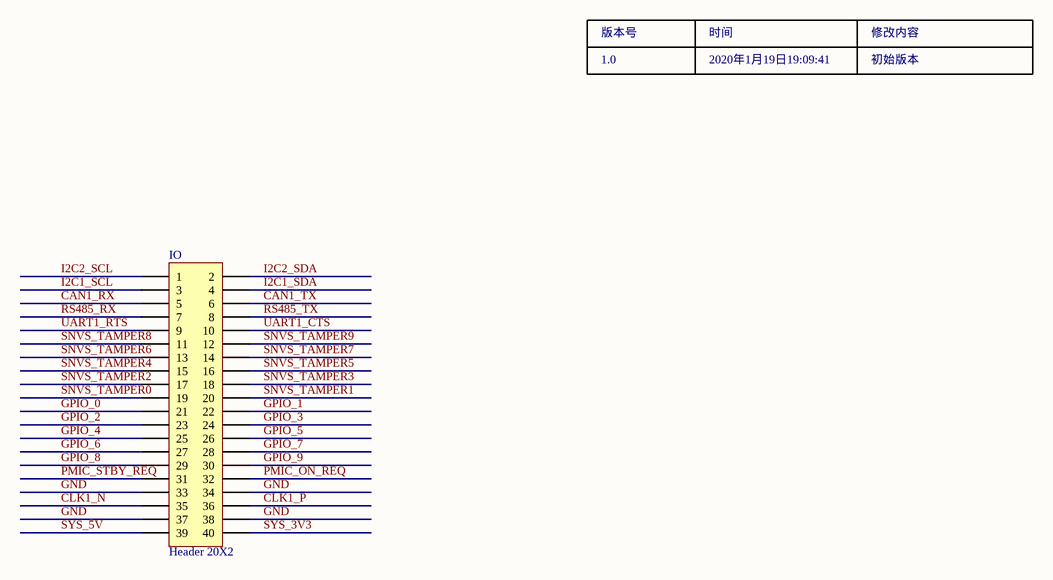
[diagram p11: 12_IO.SchDoc]

### Parts
IO  Header 20X2  [HDR2X20]

### Nets
GND: IO.33 IO.34 IO.37 IO.38
SYS_3V3: IO.40
SYS_5V: IO.39
CAN1_RX: IO.5
CAN1_TX: IO.6
CLK1_N: IO.35
CLK1_P: IO.36
GPIO_0: IO.21
GPIO_1: IO.22
GPIO_2: IO.23  [project net CSI_RST]
GPIO_3: IO.24
GPIO_4: IO.25  [project net CSI_PWDN]
GPIO_5: IO.26
GPIO_6: IO.27  [project net ENET_MDIO]
GPIO_7: IO.28  [project net ENET_MDC]
GPIO_8: IO.29
GPIO_9: IO.30
I2C1_SCL: IO.3
I2C1_SDA: IO.4
I2C2_SCL: IO.1
I2C2_SDA: IO.2
PMIC_ON_REQ: IO.32
PMIC_STBY_REQ: IO.31
RS485_RX: IO.7
RS485_TX: IO.8
SNVS_TAMPER0: IO.19  [project net KEY]
SNVS_TAMPER1: IO.20  [project net BEEP]
SNVS_TAMPER2: IO.17
SNVS_TAMPER3: IO.18  [project net NRF_CE]
SNVS_TAMPER4: IO.15  [project net AUDIO_INT]
SNVS_TAMPER5: IO.16  [project net ENET1_nINT]
SNVS_TAMPER6: IO.13  [project net ENET2_nINT]
SNVS_TAMPER7: IO.14  [project net ENET1_RST]
SNVS_TAMPER8: IO.11  [project net ENET2_RST]
SNVS_TAMPER9: IO.12  [project net LCD_INT]
UART1_CTS: IO.10  [project net HDMI_INT]
UART1_RTS: IO.9  [project net SDCARD_CD]

### Notes on the sheet
- 版本号
- 1.0
- 2020年1月19日19:09:41
- 时间
- 修改内容
- 初始版本

### Library data of the parts
IO = Header 20X2: Header, 20-Pin, Dual row; LatestRevisionDate: 17-Jul-2002; LatestRevisionNote: Re-released for DXP Platform.; Publisher: Altium Limited